# EAGLE board toro10 (EAGLE 7.7.0), part 1 of 2
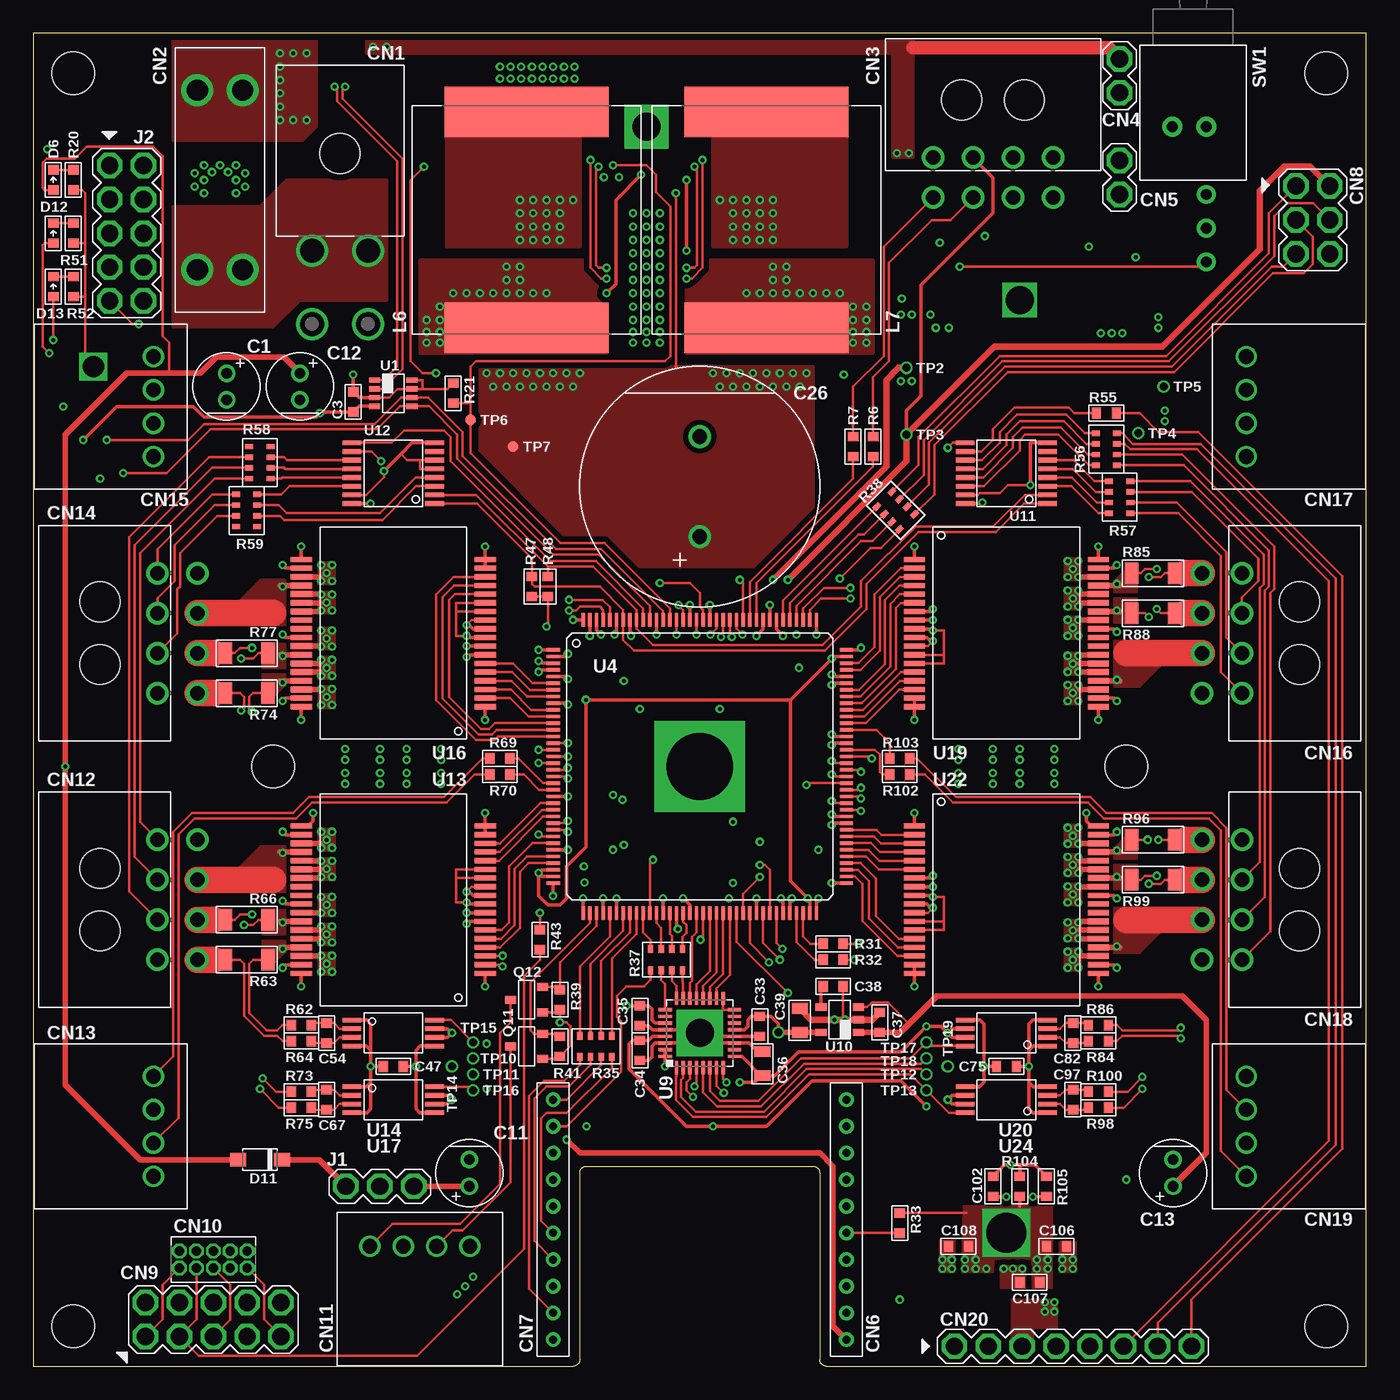
[diagram p14: board, top side]
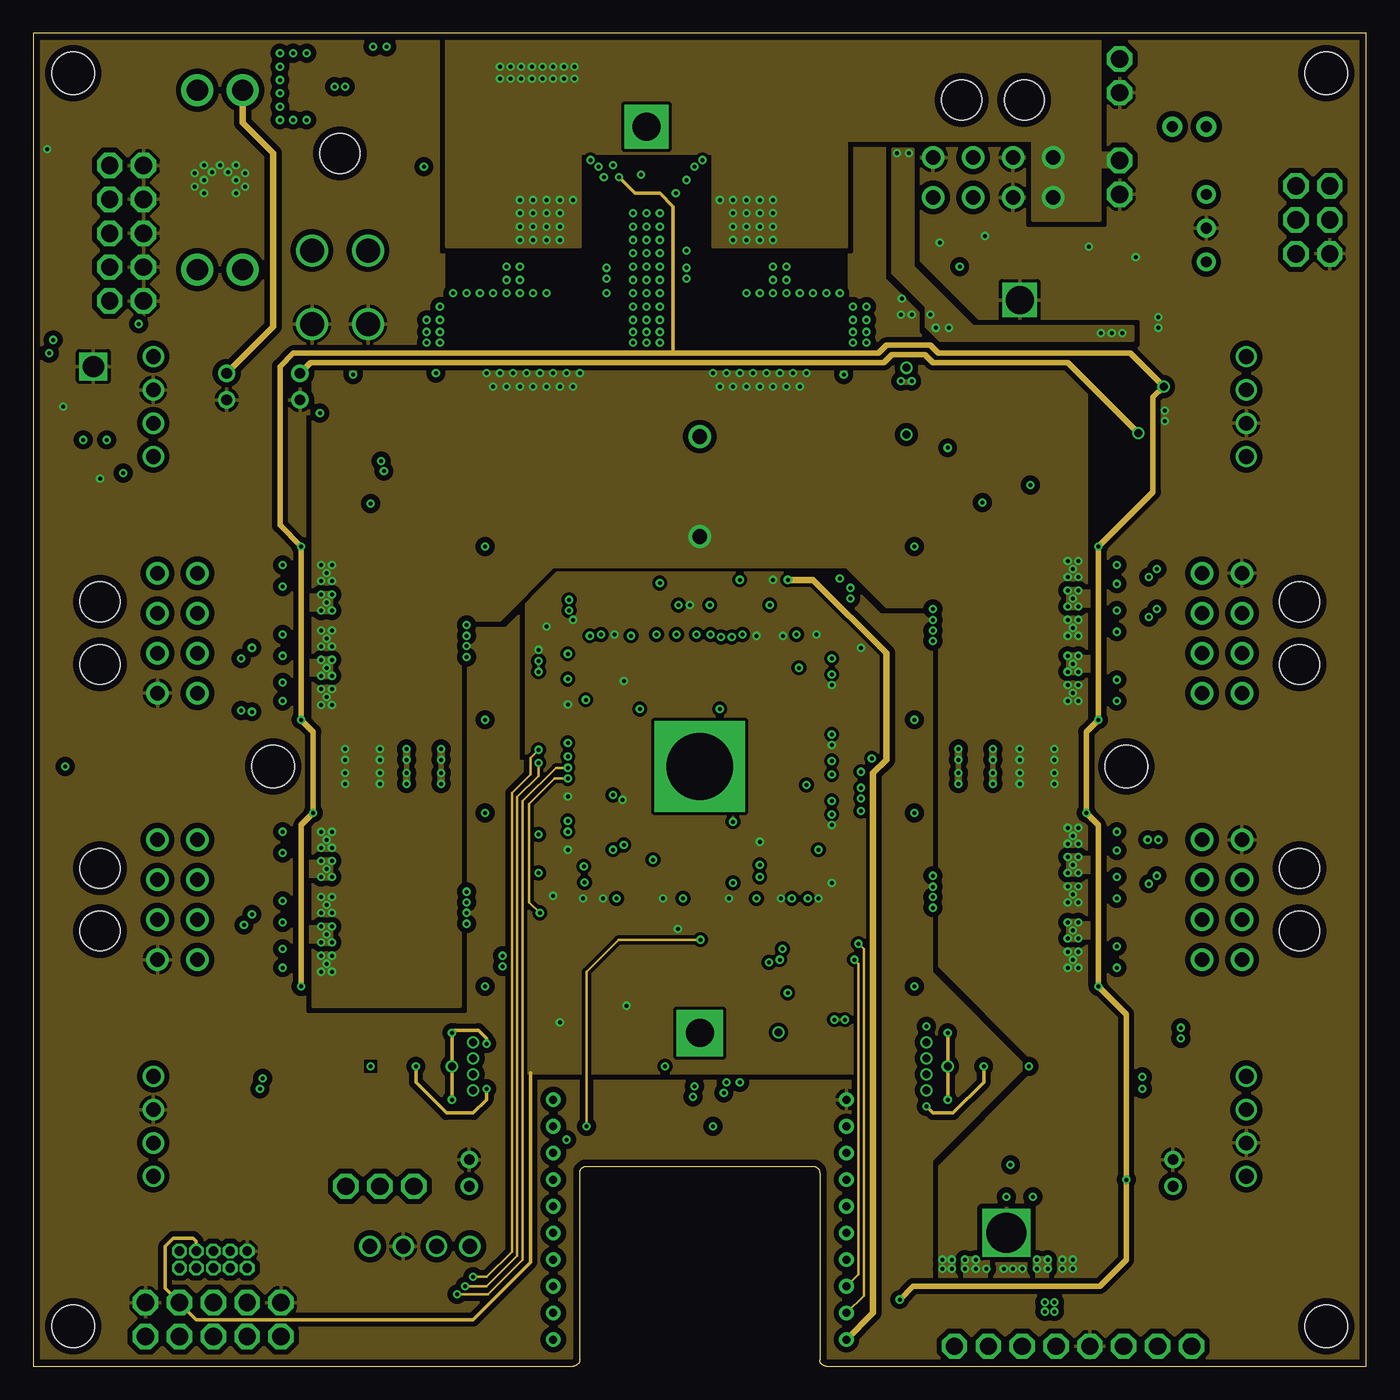
[diagram p15: board, inner layer Route2]
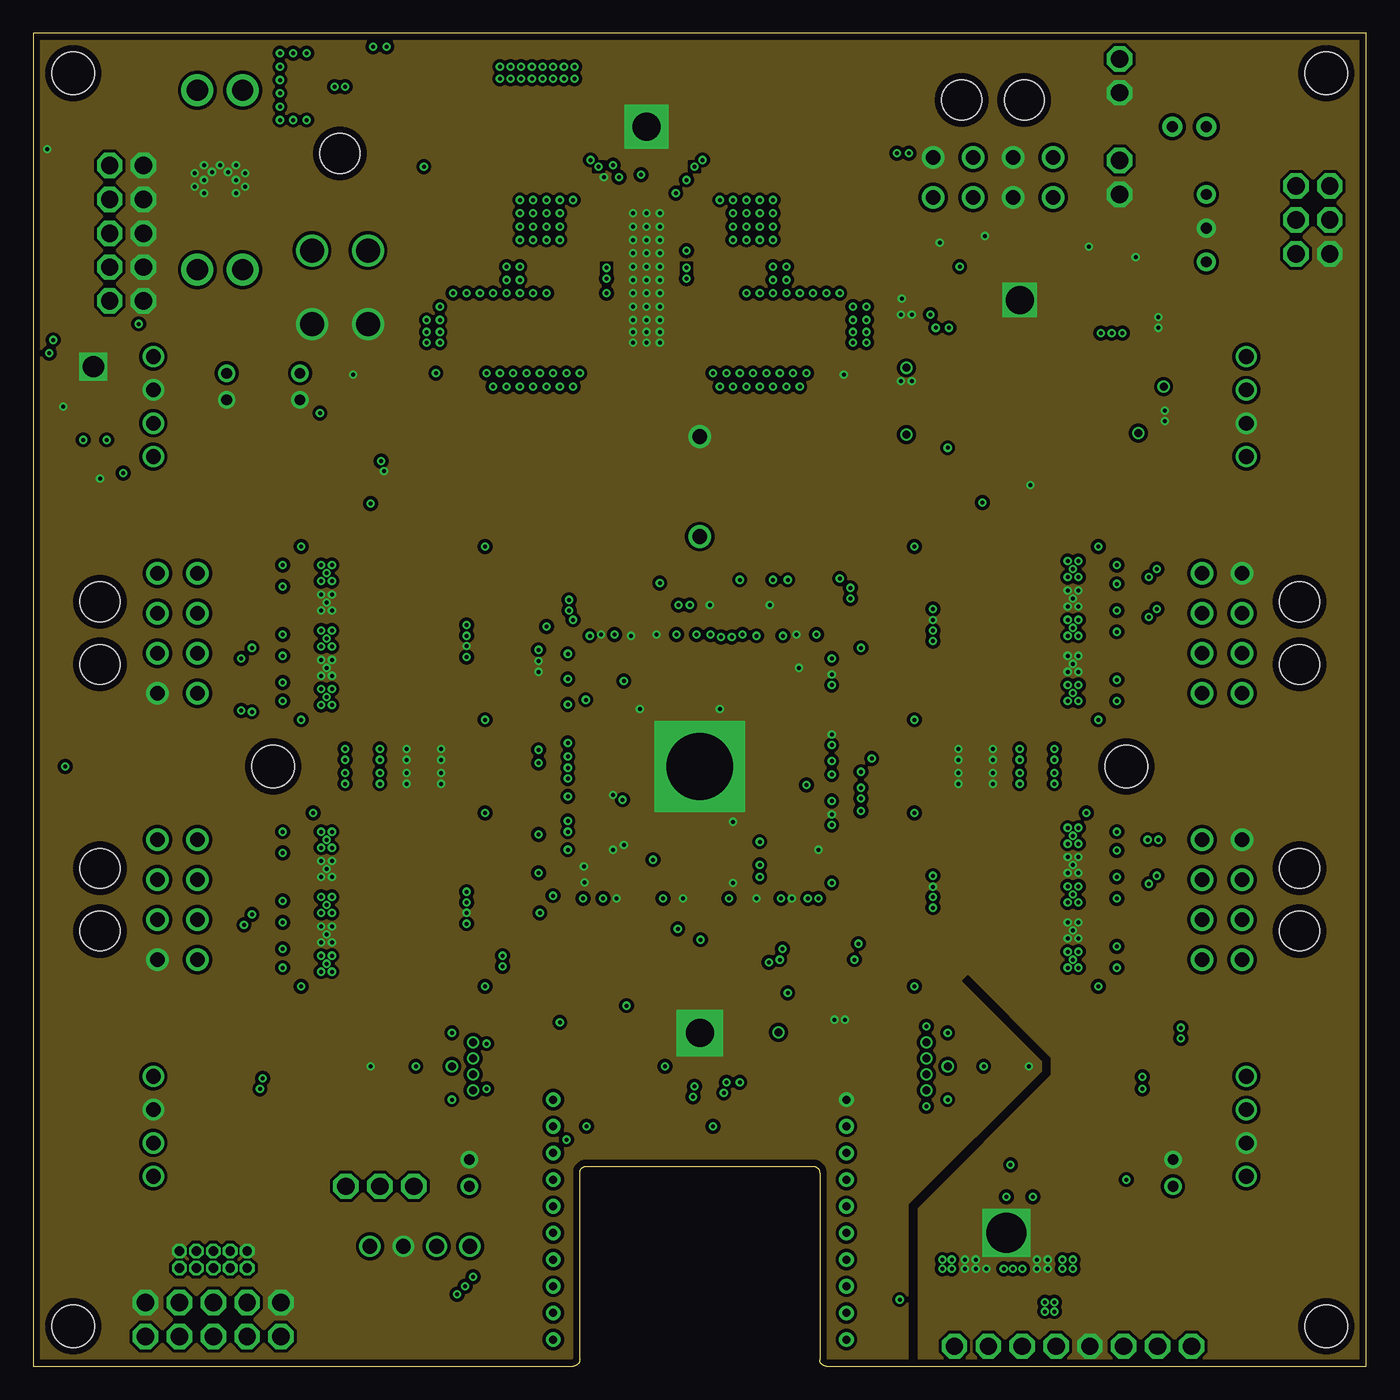
[diagram p16: board, inner layer Route15]
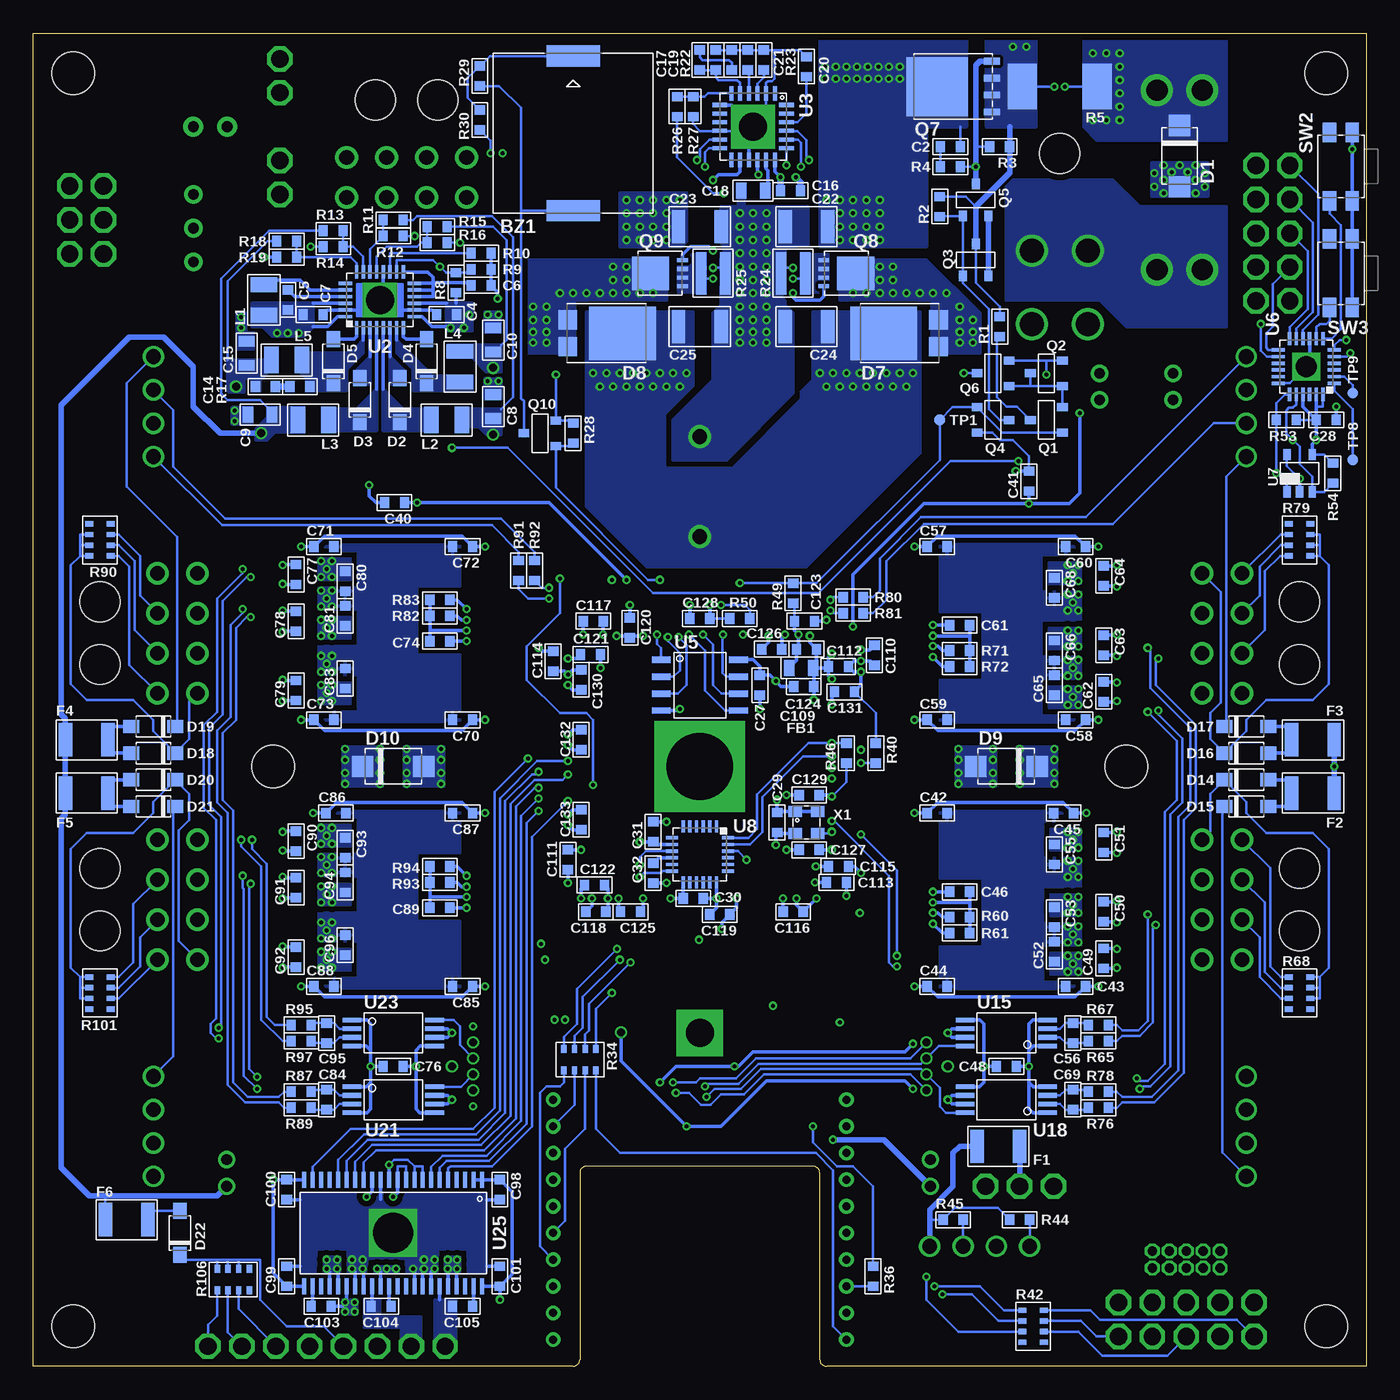
[diagram p17: board, bottom side, seen from below]

Size 100 x 100 mm. Coordinates in mm from the lower left corner, seen from the top.
Outline: 0,0 40.5,0 arc90 41,0.5 41,14.5 arc-90 41.5,15 58.5,15 arc-90 59,14.5 59,0.5 arc90 59.5,0 100,0 100,100 0,100 0,0
Copper layers (1*2*15*16): Top 0.035mm / dielectric 0.2mm / Route2 0.035mm / dielectric 1.2mm / Route15 0.035mm / dielectric 0.2mm / Bottom 0.035mm
Design rules "Elecrow_4-layer_PCB_eagle_rule *": minimum track width 6mil, minimum drill 0.3mm, track to track 6mil, track to pad 6mil, pad to pad 6mil, via to via 6mil, smd to smd 0mil, copper to edge 20mil, drill to drill 10mil, minimum pad ring 6mil, minimum via ring 6mil, stop-mask expansion 2mil, vias tented up to drill 0.3mm, thermal gap 10mil
Holes 3.2 mm at 97,97 97,3 3,3 3,97 18,45 82,45

## Footprints (pad centres in the part's own frame; a part is rotated, then mirrored left to right if it is on the bottom)
PKLCS1212 = smd 1.6 x 4: 1 -5.8,0; 2 5.8,0
E2-5 = drill 0.8 pad 1.3: N 1,0; P -1,0
1608 = smd 0.7 x 0.8: 1 -0.75,0; 2 0.75,0
2012 = smd 0.8 x 1.2: 1 -0.9,0; 2 0.9,0
3225 = smd 1 x 2.5: 1 -1.6,0; 2 1.6,0
E7.5-18 = drill 1.1 pad 1.7: N 3.75,0; P -3.75,0
5569-04A2 = drill 1.8 pad 2.4: 1 -2.1,-7.3; 2 2.1,-7.3; 3 -2.1,-12.8; 4 2.1,-12.8 | hole 3: 0,0
3557 = drill 1.6 pad 2.4: 1 -6.735,1.7; 2 -6.735,-1.7; 3 6.735,-1.7; 4 6.735,1.7
43045-0800 = drill 1.1 pad 1.7: 1 -4.5,-4.32; 2 -1.5,-4.32; 3 1.5,-4.32; 4 4.5,-4.32; 5 -4.5,-7.32; 6 -1.5,-7.32; 7 1.5,-7.32; 8 4.5,-7.32 | hole 3: 2.35,0; -2.35,0
PIN1X2 = drill 1.3 pad 1.9 octagon: 1 -1.27,0; 2 1.27,0
SOCKET1X10-TH2.0 = drill 0.6 pad 1.1: 1 -9,0; 2 -7,0; 3 -5,0; 4 -3,0; 5 -1,0; 6 1,0; 7 3,0; 8 5,0; 9 7,0; 10 9,0
PIN2X3 = drill 1.3 pad 1.9 octagon: 1 -2.54,-1.27; 2 -2.54,1.27; 3 0,-1.27; 4 0,1.27; 5 2.54,-1.27; 6 2.54,1.27
PIN2X5 = drill 1.3 pad 1.9 octagon: 1 -5.08,-1.27; 2 -5.08,1.27; 3 -2.54,-1.27; 4 -2.54,1.27; 5 0,-1.27; 6 0,1.27; 7 2.54,-1.27; 8 2.54,1.27; 9 5.08,-1.27; 10 5.08,1.27
PIN2X5-1.27 = drill 0.7 pad 1.1 octagon: 1 -2.54,-0.635; 2 -2.54,0.635; 3 -1.27,-0.635; 4 -1.27,0.635; 5 0,-0.635; 6 0,0.635; 7 1.27,-0.635; 8 1.27,0.635; 9 2.54,-0.635; 10 2.54,0.635
53426-04 = drill 1.1 pad 1.6: 1 -3.75,0; 2 -1.25,0; 3 1.25,0; 4 3.75,0
PIN1X8 = drill 1.3 pad 1.9 octagon: 1 -8.89,0; 2 -6.35,0; 3 -3.81,0; 4 -1.27,0; 5 1.27,0; 6 3.81,0; 7 6.35,0; 8 8.89,0
DO-214AC = smd 1.6 x 1.6: A 2.3,0; K -2.3,0
SOD123 = smd 1.2 x 1: A 1.65,0; K -1.65,0
1608D = smd 0.7 x 0.8: A 0.75,0; K -0.75,0
TO-277-3 = smd 1.4 x 1.45: 1 2.9,1; 2 2.9,-1 | smd 5 x 4: 3 -1.2,0
PIN1X3 = drill 1.3 pad 1.9 octagon: 1 -2.54,0; 2 0,0; 3 2.54,0
MAMK2520 = smd 1.1 x 2: 1 -1.15,0; 2 1.15,0
L-VISHAY-ER = smd 3.8 x 12.3: 1 -8.1,0; 2 8.1,0
SOT23-3 = smd 0.6 x 0.8: 1 -0.95,-1.2; 2 0.95,-1.2; 3 0,1.2
POWERPAK-SO-8-S = smd 0.5 x 1.2: 1 -1.905,-2.9; 2 -0.635,-2.9; 3 0.635,-2.9; 4 1.905,-2.9 | smd 4.4 x 4.6: D 0,1.2
TSON-8_3.3 = smd 0.8 x 0.32: 1 -1.7,0.975; 2 -1.7,0.325; 3 -1.7,-0.325; 4 -1.7,-0.975 | smd 2.8 x 2.5: D 0.7,0
WSLF2512 = smd 2.2 x 3.4: 1 -2.8,0; 2 2.8,0
3216WL = smd 0.8 x 3.2: 1 -0.9,0; 2 0.9,0
1608-4A = smd 0.6 x 0.4: A1 -0.8,1.2; A2 0.8,1.2; B1 -0.8,0.4; B2 0.8,0.4; C1 -0.8,-0.4; C2 0.8,-0.4; D1 -0.8,-1.2; D2 0.8,-1.2
3216 = smd 1 x 1.6: 1 -1.6,0; 2 1.6,0
B-12JV = drill 0.8 pad 1.4: 1 10.16,1; 2 7.62,1; 3 5.08,1 | drill 0.8 pad 1.5: S1 0,1; S2 0,-1.54
EVQ-PU_BK = smd 1.45 x 1: A1 -2.575,-0.85; A2 2.575,-0.85; B1 -2.575,0.85; B2 2.575,0.85
TESTPAD-SMT = smd 0.8 x 0.8: 1 0,0
TESTPAD-TH = drill 0.6: 1 0,0
SOT23-8 = smd 0.4 x 0.85: 1 -0.975,-1.4; 2 -0.325,-1.4; 3 0.325,-1.4; 4 0.975,-1.4; 5 0.975,1.4; 6 0.325,1.4; 7 -0.325,1.4; 8 -0.975,1.4
QFN28-0.5 = smd 1 x 0.25: 1 -2.1,1.75; 2 -2.1,1.25; 3 -2.1,0.75; 4 -2.1,0.25; 5 -2.1,-0.25; 6 -2.1,-0.75; 7 -2.1,-1.25; 8 -2.1,-1.75; 15 2.1,-1.75; 16 2.1,-1.25; 17 2.1,-0.75; 18 2.1,-0.25; 19 2.1,0.25; 20 2.1,0.75; 21 2.1,1.25; 22 2.1,1.75 | smd 0.25 x 1: 9 -1.25,-2.6; 10 -0.75,-2.6; 11 -0.25,-2.6; 12 0.25,-2.6; 13 0.75,-2.6; 14 1.25,-2.6; 23 1.25,2.6; 24 0.75,2.6; 25 0.25,2.6; 26 -0.25,2.6; 27 -0.75,2.6; 28 -1.25,2.6 | drill 2.1 pad 2.6 square: PAD 0,0
QFN24-0.65 = smd 1.1 x 0.3: 1 -2.5,1.625; 2 -2.5,0.975; 3 -2.5,0.325; 4 -2.5,-0.325; 5 -2.5,-0.975; 6 -2.5,-1.625; 13 2.5,-1.625; 14 2.5,-0.975; 15 2.5,-0.325; 16 2.5,0.325; 17 2.5,0.975; 18 2.5,1.625 | smd 0.3 x 1.1: 7 -1.625,-2.5; 8 -0.975,-2.5; 9 -0.325,-2.5; 10 0.325,-2.5; 11 0.975,-2.5; 12 1.625,-2.5; 19 1.625,2.5; 20 0.975,2.5; 21 0.325,2.5; 22 -0.325,2.5; 23 -0.975,2.5; 24 -1.625,2.5 | drill 2.1 pad 3.3 square: PAD 0,0
QFP144-0.5-PAD = smd 1 x 0.25: 1 -11,8.75; 2 -11,8.25; 3 -11,7.75; 4 -11,7.25; 5 -11,6.75; 6 -11,6.25; 7 -11,5.75; 8 -11,5.25; 9 -11,4.75; 10 -11,4.25; 11 -11,3.75; 12 -11,3.25; 13 -11,2.75; 14 -11,2.25; 15 -11,1.75; 16 -11,1.25; 17 -11,0.75; 18 -11,0.25; 19 -11,-0.25; 20 -11,-0.75; 21 -11,-1.25; 22 -11,-1.75; 23 -11,-2.25; 24 -11,-2.75; 25 -11,-3.25; 26 -11,-3.75; 27 -11,-4.25; 28 -11,-4.75; 29 -11,-5.25; 30 -11,-5.75; 31 -11,-6.25; 32 -11,-6.75; 33 -11,-7.25; 34 -11,-7.75; 35 -11,-8.25; 36 -11,-8.75; 73 11,-8.75; 74 11,-8.25; 75 11,-7.75; 76 11,-7.25; 77 11,-6.75; 78 11,-6.25; 79 11,-5.75; 80 11,-5.25; 81 11,-4.75; 82 11,-4.25; 83 11,-3.75; 84 11,-3.25; 85 11,-2.75; 86 11,-2.25; 87 11,-1.75; 88 11,-1.25; 89 11,-0.75; 90 11,-0.25; 91 11,0.25; 92 11,0.75; 93 11,1.25; 94 11,1.75; 95 11,2.25; 96 11,2.75; 97 11,3.25; 98 11,3.75; 99 11,4.25; 100 11,4.75; 101 11,5.25; 102 11,5.75; 103 11,6.25; 104 11,6.75; 105 11,7.25; 106 11,7.75; 107 11,8.25; 108 11,8.75 | smd 0.25 x 1: 37 -8.75,-11; 38 -8.25,-11; 39 -7.75,-11; 40 -7.25,-11; 41 -6.75,-11; 42 -6.25,-11; 43 -5.75,-11; 44 -5.25,-11; 45 -4.75,-11; 46 -4.25,-11; 47 -3.75,-11; 48 -3.25,-11; 49 -2.75,-11; 50 -2.25,-11; 51 -1.75,-11; 52 -1.25,-11; 53 -0.75,-11; 54 -0.25,-11; 55 0.25,-11; 56 0.75,-11; 57 1.25,-11; 58 1.75,-11; 59 2.25,-11; 60 2.75,-11; 61 3.25,-11; 62 3.75,-11; 63 4.25,-11; 64 4.75,-11; 65 5.25,-11; 66 5.75,-11; 67 6.25,-11; 68 6.75,-11; 69 7.25,-11; 70 7.75,-11; 71 8.25,-11; 72 8.75,-11; 109 8.75,11; 110 8.25,11; 111 7.75,11; 112 7.25,11; 113 6.75,11; 114 6.25,11; 115 5.75,11; 116 5.25,11; 117 4.75,11; 118 4.25,11; 119 3.75,11; 120 3.25,11; 121 2.75,11; 122 2.25,11; 123 1.75,11; 124 1.25,11; 125 0.75,11; 126 0.25,11; 127 -0.25,11; 128 -0.75,11; 129 -1.25,11; 130 -1.75,11; 131 -2.25,11; 132 -2.75,11; 133 -3.25,11; 134 -3.75,11; 135 -4.25,11; 136 -4.75,11; 137 -5.25,11; 138 -5.75,11; 139 -6.25,11; 140 -6.75,11; 141 -7.25,11; 142 -7.75,11; 143 -8.25,11; 144 -8.75,11 | drill 5 pad 6.8 square: PAD 0,0
SOP8 = smd 0.48 x 1.4: 1 -1.905,-2.9; 2 -0.635,-2.9; 3 0.635,-2.9; 4 1.905,-2.9; 5 1.905,2.9; 6 0.635,2.9; 7 -0.635,2.9; 8 -1.905,2.9
QFN24-0.5 = smd 1 x 0.25: 1 -2.1,1.25; 2 -2.1,0.75; 3 -2.1,0.25; 4 -2.1,-0.25; 5 -2.1,-0.75; 6 -2.1,-1.25; 13 2.1,-1.25; 14 2.1,-0.75; 15 2.1,-0.25; 16 2.1,0.25; 17 2.1,0.75; 18 2.1,1.25 | smd 0.25 x 1: 7 -1.25,-2.1; 8 -0.75,-2.1; 9 -0.25,-2.1; 10 0.25,-2.1; 11 0.75,-2.1; 12 1.25,-2.1; 19 1.25,2.1; 20 0.75,2.1; 21 0.25,2.1; 22 -0.25,2.1; 23 -0.75,2.1; 24 -1.25,2.1 | drill 1.6 pad 2.1 square: PAD 0,0
SOT23-5 = smd 0.55 x 0.85: 1 -0.95,-1.4; 2 0,-1.4; 3 0.95,-1.4; 4 0.95,1.4; 5 -0.95,1.4
QFN24-0.5-INVEN = smd 0.9 x 0.25: 1 -2.1,1.25; 2 -2.1,0.75; 3 -2.1,0.25; 4 -2.1,-0.25; 5 -2.1,-0.75; 6 -2.1,-1.25; 13 2.1,-1.25; 14 2.1,-0.75; 15 2.1,-0.25; 16 2.1,0.25; 17 2.1,0.75; 18 2.1,1.25 | smd 0.25 x 0.9: 7 -1.25,-2.1; 8 -0.75,-2.1; 9 -0.25,-2.1; 10 0.25,-2.1; 11 0.75,-2.1; 12 1.25,-2.1; 19 1.25,2.1; 20 0.75,2.1; 21 0.25,2.1; 22 -0.25,2.1; 23 -0.75,2.1; 24 -1.25,2.1
QFN32-0.5 = smd 1 x 0.25: 1 -2.6,1.75; 2 -2.6,1.25; 3 -2.6,0.75; 4 -2.6,0.25; 5 -2.6,-0.25; 6 -2.6,-0.75; 7 -2.6,-1.25; 8 -2.6,-1.75; 17 2.6,-1.75; 18 2.6,-1.25; 19 2.6,-0.75; 20 2.6,-0.25; 21 2.6,0.25; 22 2.6,0.75; 23 2.6,1.25; 24 2.6,1.75 | smd 0.25 x 1: 9 -1.75,-2.6; 10 -1.25,-2.6; 11 -0.75,-2.6; 12 -0.25,-2.6; 13 0.25,-2.6; 14 0.75,-2.6; 15 1.25,-2.6; 16 1.75,-2.6; 25 1.75,2.6; 26 1.25,2.6; 27 0.75,2.6; 28 0.25,2.6; 29 -0.25,2.6; 30 -0.75,2.6; 31 -1.25,2.6; 32 -1.75,2.6 | drill 2.1 pad 3.5 square: PAD 0,0
TSSOP16 = smd 0.35 x 1.4: 1 -2.275,-3.1; 2 -1.625,-3.1; 3 -0.975,-3.1; 4 -0.325,-3.1; 5 0.325,-3.1; 6 0.975,-3.1; 7 1.625,-3.1; 8 2.275,-3.1; 9 2.275,3.1; 10 1.625,3.1; 11 0.975,3.1; 12 0.325,3.1; 13 -0.325,3.1; 14 -0.975,3.1; 15 -1.625,3.1; 16 -2.275,3.1
HSSOP36 = smd 0.381 x 1.6: 1 -5.525,-6.9; 2 -4.875,-6.9; 3 -4.225,-6.9; 4 -3.575,-6.9; 5 -2.925,-6.9; 6 -2.275,-6.9; 7 -1.625,-6.9; 8 -0.975,-6.9; 9 -0.325,-6.9; 10 0.325,-6.9; 11 0.975,-6.9; 12 1.625,-6.9; 13 2.275,-6.9; 14 2.925,-6.9; 15 3.575,-6.9; 16 4.225,-6.9; 17 4.875,-6.9; 18 5.525,-6.9; 19 5.525,6.9; 20 4.875,6.9; 26 0.975,6.9; 27 0.325,6.9; 28 -0.325,6.9; 35 -4.875,6.9; 36 -5.525,6.9 | smd 0.44 x 1.6: 21 4.225,6.9; 22 3.575,6.9; 23 2.925,6.9; 24 2.275,6.9; 25 1.625,6.9; 29 -0.975,6.9; 30 -1.625,6.9; 31 -2.275,6.9; 32 -2.925,6.9; 33 -3.575,6.9; 34 -4.225,6.9
TSSOP8 = smd 0.35 x 1.4: 1 -0.975,-3.1; 2 -0.325,-3.1; 3 0.325,-3.1; 4 0.975,-3.1; 5 0.975,3.1; 6 0.325,3.1; 7 -0.325,3.1; 8 -0.975,3.1
HTSSOP44 = smd 0.3 x 1.2: 1 -6.668,-4; 2 -6.032,-4; 3 -5.397,-4; 4 -4.763,-4; 5 -4.128,-4; 6 -3.493,-4; 7 -2.857,-4; 8 -2.223,-4; 9 -1.587,-4; 10 -0.953,-4; 11 -0.318,-4; 12 0.318,-4; 13 0.953,-4; 14 1.587,-4; 15 2.223,-4; 16 2.857,-4; 17 3.493,-4; 18 4.128,-4; 19 4.763,-4; 20 5.397,-4; 21 6.032,-4; 22 6.668,-4; 23 6.668,4; 24 6.032,4; 25 5.397,4; 26 4.763,4; 27 4.128,4; 28 3.493,4; 29 2.857,4; 30 2.223,4; 31 1.587,4; 32 0.953,4; 33 0.318,4; 34 -0.318,4; 35 -0.953,4; 36 -1.587,4; 37 -2.223,4; 38 -2.857,4; 39 -3.493,4; 40 -4.128,4; 41 -4.763,4; 42 -5.397,4; 43 -6.032,4; 44 -6.668,4 | drill 3 pad 3.6 square: PAD 0,0
OSC2520 = smd 0.8 x 1: 1 -0.825,-0.85; 2 0.825,-0.85; 3 0.825,0.85; 4 -0.825,0.85

## Placement (x,y rotation side)
BZ1  PKLCS1212E4001-R1  [PKLCS1212]  59.5,92.5 90 bottom
C1  47u  [E2-5]  14.5,73.5 270 top
C2  100n  [1608]  31.2,91.5 180 bottom
C3  100n  [1608]  24,72.35 90 top
C4  1u  [1608]  69,78.9 180 bottom
C5  1u  [1608]  80.9,80 270 bottom
C6  100n  [1608]  66.4,81.1 0 bottom
C7  1u  [1608]  79,78.9 0 bottom
C8  10u  [2012]  65.5,72 90 bottom
C9  10u  [2012]  83,71.4 180 bottom
C10  10u  [2012]  65.5,77 90 bottom
C11  100u  [E2-5]  32.7,14.5 90 top
C12  100u  [E2-5]  20,73.5 270 top
C13  100u  [E2-5]  85.5,14.5 90 top
C14  1n  [1608]  82.6,73.5 180 bottom
C15  10u  [2012]  84,76 90 bottom
C16  1u  [1608]  43.2,88.2 0 bottom
C17  10n  [1608]  50,98 90 bottom
C18  10u  [2012]  46,88.2 180 bottom
C19  100p  [1608]  48.8,98 90 bottom
C20  1n  [1608]  42,97.5 90 bottom
C21  100n  [1608]  46.4,98 90 bottom
C22  10u  [3225]  42,85.5 180 bottom
C23  10u  [3225]  50,85.5 0 bottom
C24  10u  [3225]  42,78 180 bottom
C25  10u  [3225]  50,78 0 bottom
C26  390u  [E7.5-18]  50,66 90 top
C27  100n  [1608]  45.5,51.1 270 bottom
C28  100n  [1608]  3,71 0 bottom
C29  10n  [1608]  44.2,40.8 270 bottom
C30  1u  [1608]  50.5,35.1 0 bottom
C31  100n  [1608]  53.5,40.1 90 bottom
C32  1u  [1608]  53.5,37 270 bottom
C33  1u  [1608]  54.5,25.5 270 top
C34  1u  [1608]  45.5,23.7 270 top
C35  1u  [1608]  45.5,26.3 270 top
C36  22u  [2012]  54.7,22.7 90 top
C37  1u  [1608]  63.5,25.8 90 top
C38  10n  [1608]  60,28.5 0 top
C39  10u  [2012]  57.5,25.95 90 top
C40  100n  [1608]  72.9,64.8 180 bottom
C41  100n  [1608]  25.3,66.4 90 bottom
C42  1u  [1608]  32.2,41.5 0 bottom
C43  1u  [1608]  21.8,28.5 180 bottom
C44  1u  [1608]  32.2,28.5 0 bottom
C45  1u  [1608]  22.7,41.5 180 bottom
C46  100n  [1608]  30.5,35.6 180 bottom
C47  100n  [1608]  27,22.5 180 top
C48  100n  [1608]  27,22.5 0 bottom
C49  100n  [1608]  19.7,30.6 90 bottom
C50  100n  [1608]  19.7,34.1 270 bottom
C51  100n  [1608]  19.7,39.3 270 bottom
C52  100n  [1608]  23.4,31.1 90 bottom
C53  100n  [1608]  23.4,33.7 270 bottom
C54  DNC  [1608]  22,25 270 top
C55  100n  [1608]  23.4,38.4 270 bottom
C56  DNC  [1608]  22,25 90 bottom
C57  1u  [1608]  32.2,61.5 0 bottom
C58  1u  [1608]  21.8,48.5 180 bottom
C59  1u  [1608]  32.2,48.5 0 bottom
C60  1u  [1608]  21.8,61.5 180 bottom
C61  100n  [1608]  30.5,55.6 180 bottom
C62  100n  [1608]  19.7,50.6 90 bottom
C63  100n  [1608]  19.7,54.1 270 bottom
C64  100n  [1608]  19.7,59.3 270 bottom
C65  100n  [1608]  23.4,51.1 90 bottom
C66  100n  [1608]  23.4,53.7 270 bottom
C67  DNC  [1608]  22,20 270 top
C68  100n  [1608]  23.4,58.4 270 bottom
C69  DNC  [1608]  22,20 90 bottom
C70  1u  [1608]  67.8,48.5 180 bottom
C71  1u  [1608]  78.2,61.5 0 bottom
C72  1u  [1608]  67.8,61.5 180 bottom
C73  1u  [1608]  78.2,48.5 0 bottom
C74  100n  [1608]  69.5,54.4 0 bottom
C75  100n  [1608]  73,22.5 0 top
C76  100n  [1608]  73,22.5 180 bottom
C77  100n  [1608]  80.3,59.4 270 bottom
C78  100n  [1608]  80.3,55.9 90 bottom
C79  100n  [1608]  80.3,50.7 90 bottom
C80  100n  [1608]  76.6,58.9 270 bottom
C81  100n  [1608]  76.6,56.3 90 bottom
C82  DNC  [1608]  78,25 90 top
C83  100n  [1608]  76.6,51.6 90 bottom
C84  DNC  [1608]  78,20 270 bottom
C85  1u  [1608]  67.8,28.5 180 bottom
C86  1u  [1608]  77.3,41.5 0 bottom
C87  1u  [1608]  67.8,41.5 180 bottom
C88  1u  [1608]  78.2,28.5 0 bottom
C89  100n  [1608]  69.5,34.4 0 bottom
C90  100n  [1608]  80.3,39.4 270 bottom
C91  100n  [1608]  80.3,35.9 90 bottom
C92  100n  [1608]  80.3,30.7 90 bottom
C93  100n  [1608]  76.6,38.9 270 bottom
C94  100n  [1608]  76.6,36.3 90 bottom
C95  DNC  [1608]  78,25 270 bottom
C96  100n  [1608]  76.6,31.6 90 bottom
C97  DNC  [1608]  78,20 90 top
C98  1u  [1608]  65,13.25 270 bottom
C99  1u  [1608]  81,6.75 90 bottom
C100  1u  [1608]  81,13.25 270 bottom
C101  1u  [1608]  65,6.75 90 bottom
C102  100n  [1608]  72,13.5 270 top
C103  100n  [1608]  78.4,4.5 0 bottom
C104  100n  [1608]  73.9,4.5 180 bottom
C105  100n  [1608]  67.8,4.5 180 bottom
C106  100n  [1608]  76.75,9 180 top
C107  100n  [1608]  74.75,6.3 0 top
C108  100n  [1608]  69.4,9 0 top
C109  10u  [2012]  42.4,52.4 180 bottom
C110  100n  [1608]  36.9,53.35 270 bottom
C111  100n  [1608]  59.9,38 90 bottom
C112  100n  [1608]  39.6,52.5 0 bottom
C113  100n  [1608]  39.75,36.3 180 bottom
C114  100n  [1608]  61,52.9 270 bottom
C115  100n  [1608]  39.6,37.5 180 bottom
C116  100n  [1608]  43,34.1 180 bottom
C117  100n  [1608]  58,55.9 0 bottom
C118  100n  [1608]  57.8,34.1 0 bottom
C119  100n  [1608]  48.5,33.9 180 bottom
C120  100n  [1608]  55.25,55.4 90 bottom
C121  100n  [1608]  58.2,53.4 0 bottom
C122  100n  [1608]  57.9,36.1 0 bottom
C123  100n  [1608]  42.15,55.9 180 bottom
C124  100n  [1608]  42,53.8 180 bottom
C125  100n  [1608]  55.2,34.1 0 bottom
C126  100n  [1608]  44.6,53.8 180 bottom
C127  100n  [1608]  41.8,38.75 180 bottom
C128  100n  [1608]  50,56.1 180 bottom
C129  100n  [1608]  41.8,42.85 180 bottom
C130  100n  [1608]  58.9,51.5 90 bottom
C131  100n  [1608]  39.15,50.6 0 bottom
C132  100n  [1608]  58.9,47 90 bottom
C133  100n  [1608]  58.9,41 90 bottom
CN1  5569-04A2  [5569-04A2]  23,91 0 top
CN2  3557-20  [3557]  14,89 270 top
CN3  43045-0800  [43045-0800]  72,95 0 top
CN4  [PIN1X2]  81.5,96.81 270 top
CN5  [PIN1X2]  81.5,89.19 270 top
CN6  SOCKET1X10  [SOCKET1X10-TH2.0]  61,11 90 top
CN7  SOCKET1X10  [SOCKET1X10-TH2.0]  39,11 270 top
CN8  External  [PIN2X3]  96,86 270 top
CN9  ALTERA-JTAG-TH2.54  [PIN2X5]  13.5,3.5 0 top
CN10  ALTERA-JTAG-TH1.27  [PIN2X5-1.27]  13.5,8 0 top
CN11  53426-0410  [53426-04]  29,9 0 top
CN12  43045-0800  [43045-0800]  5,35 90 top
CN13  53426-0410  [53426-04]  9,18 270 top
CN14  43045-0800  [43045-0800]  5,55 90 top
CN15  53426-0410  [53426-04]  9,72 270 top
CN16  43045-0800  [43045-0800]  95,55 270 top
CN17  53426-0410  [53426-04]  91,72 90 top
CN18  43045-0800  [43045-0800]  95,35 270 top
CN19  53426-0410  [53426-04]  91,18 90 top
CN20  PIN1X8  [PIN1X8]  78,1.5 0 top
D1  SMAJ26A  [DO-214AC]  14,90.8 270 bottom
D2  SS2040FL  [SOD123]  72.5,72.5 90 bottom
D3  SS2040FL  [SOD123]  75.5,72.5 90 bottom
D4  SS2040FL  [SOD123]  70.5,75.4 90 bottom
D5  SS2040FL  [SOD123]  77.5,75.4 90 bottom
D6  Orange LED  [1608D]  1.5,89 270 top
D7  FSV2060L  [TO-277-3]  35,77.5 0 bottom
D8  FSV2060L  [TO-277-3]  57,77.5 180 bottom
D9  SMAJ48A  [DO-214AC]  27,45 180 bottom
D10  SMAJ48A  [DO-214AC]  73,45 0 bottom
D11  GS1010FL  [SOD123]  17,15.5 180 top
D12  Green LED  [1608D]  1.5,85 270 top
D13  Red LED  [1608D]  1.5,81 270 top
D14  GS1010FL  [SOD123]  9,44 0 bottom
D15  GS1010FL  [SOD123]  9,42 0 bottom
D16  GS1010FL  [SOD123]  9,46 0 bottom
D17  GS1010FL  [SOD123]  9,48 0 bottom
D18  GS1010FL  [SOD123]  91,46 180 bottom
D19  GS1010FL  [SOD123]  91,48 180 bottom
D20  GS1010FL  [SOD123]  91,44 180 bottom
D21  GS1010FL  [SOD123]  91,42 180 bottom
D22  GS1010FL  [SOD123]  89,10 90 bottom
F1  MICROSMD010-2  [3225]  27.6,16.5 180 bottom
F2  MICROSMD010-2  [3225]  4,43 180 bottom
F3  MICROSMD010-2  [3225]  4,47 180 bottom
F4  MICROSMD010-2  [3225]  96,47 0 bottom
F5  MICROSMD010-2  [3225]  96,43 0 bottom
F6  MICROSMD010-2  [3225]  93,11 0 bottom
FB1  BLM18PG471SN1D  [1608]  42.2,51 0 bottom
J1  JUMPER1X3  [PIN1X3]  26,13.5 0 top
J2  JUMPER2X5  [PIN2X5]  7,85 270 top
L1  4.7u  [MAMK2520]  82.7,80 90 bottom
L2  4.7u  [MAMK2520]  69,71 0 bottom
L3  4.7u  [MAMK2520]  79,71 180 bottom
L4  4.7u  [MAMK2520]  68,75 90 bottom
L5  4.7u  [MAMK2520]  81,75.5 180 bottom
L6  8.2u  [L-VISHAY-ER]  37,86 270 top
L7  8.2u  [L-VISHAY-ER]  55,86 270 top
Q1  BSS138  [SOT23-3]  24,71 90 bottom
Q2  2SC2712  [SOT23-3]  24,74.5 90 bottom
Q3  BSS138  [SOT23-3]  29.3,83 0 bottom
Q4  BSS138  [SOT23-3]  28,71 270 bottom
Q5  BSS138  [SOT23-3]  29.3,87.5 0 bottom
Q6  2SC2712  [SOT23-3]  28,74.5 90 bottom
Q7  SI7135DP  [POWERPAK-SO-8-S]  31,96 90 bottom
Q8  TPN7R506NH  [TSON-8_3.3]  39,82 0 bottom
Q9  TPN7R506NH  [TSON-8_3.3]  53,82 180 bottom
Q10  BSS138  [SOT23-3]  62,70 90 bottom
Q11  BSS138  [SOT23-3]  37,24 90 top
Q12  BSS138  [SOT23-3]  37,27.5 90 top
R1  220k  [1608]  27.5,78 90 bottom
R2  10k  [1608]  32,87 270 bottom
R3  220k  [1608]  27.5,91.5 180 bottom
R4  1k  [1608]  31.2,90 180 bottom
R5  1m  [WSLF2512]  23,96 180 bottom
R6  51  [1608]  63,69 270 top
R7  51  [1608]  61.5,69 270 top
R8  270k  [1608]  68.3,81.3 270 bottom
R9  22k  [1608]  66.4,82.3 180 bottom
R10  10k  [1608]  66.4,83.5 180 bottom
R11  47k  [1608]  73,86 0 bottom
R12  15k  [1608]  73,84.8 180 bottom
R13  130k  [1608]  77.5,85.2 180 bottom
R14  22k  [1608]  77.5,84 0 bottom
R15  130k  [1608]  69.7,85.5 0 bottom
R16  47k  [1608]  69.7,84.3 180 bottom
R17  1k  [1608]  80,73.5 180 bottom
R18  47k  [1608]  81,84.4 180 bottom
R19  3.3k  [1608]  81,83.2 0 bottom
R20  4.7k  [1608]  3,89 90 top
R21  2.2k  [1608]  31.5,73 270 top
R22  68.1k  [1608]  47.6,98 270 bottom
R23  33k  [1608]  45.2,98 270 bottom
R24  5m  [3216WL]  43,82 0 bottom
R25  5m  [3216WL]  49,82 180 bottom
R26  180k  [1608]  51.7,94.5 270 bottom
R27  4.7k  [1608]  50.5,94.5 90 bottom
R28  4.7k  [1608]  59.5,70 270 bottom
R29  1k  [1608]  66.5,96.8 90 bottom
R30  1k  [1608]  66.5,93.5 270 bottom
R31  51  [1608]  60,31.7 0 top
R32  51  [1608]  60,30.5 0 top
R33  2.2k  [1608]  65,10.75 270 top
R34  51  [1608-4A]  59,23 270 bottom
R35  51  [1608-4A]  42.2,24 90 top
R36  51  [1608]  37,6.75 90 bottom
R37  51  [1608-4A]  47.5,30.5 90 top
R38  51  [1608-4A]  64.7,64.2 45 top
R39  4.7k  [1608]  39.5,27.5 270 top
R40  10k  [1608]  36.8,46 270 bottom
R41  4.7k  [1608]  39.5,24 270 top
R42  51  [1608-4A]  25,3 0 bottom
R43  51  [1608]  38,32 270 top
R44  2.2k  [1608]  26,11 180 bottom
R45  2.2k  [1608]  31,11 180 bottom
R46  10k  [1608]  39,46 270 bottom
R47  10k  [1608]  37.4,58.5 270 top
R48  10k  [1608]  38.6,58.5 270 top
R49  2.2k  [1608]  43,58 270 bottom
R50  10k  [1608]  47,56.1 180 bottom
R51  1k  [1608]  3,85 270 top
R52  1k  [1608]  3,81 270 top
R53  2.2k  [1608]  6,71 0 bottom
R54  2.2k  [1608]  2.5,67 90 bottom
R55  10k  [1608]  80.5,71.5 0 top
R56  1k  [1608-4A]  80.5,68.8 0 top
R57  1k  [1608-4A]  81.5,65.2 0 top
R58  1k  [1608-4A]  17,67.8 180 top
R59  1k  [1608-4A]  16,64.2 180 top
R60  1  [1608]  30.5,33.7 0 bottom
R61  22k  [1608]  30.5,32.5 180 bottom
R62  0  [1608]  20.1,25.6 180 top
R63  2m  [3216]  16,30.5 180 top
R64  0  [1608]  20.1,24.4 180 top
R65  0  [1608]  20.1,24.4 0 bottom
R66  2m  [3216]  16,33.5 180 top
R67  0  [1608]  20.1,25.6 0 bottom
R68  100k  [1608-4A]  5,28 0 bottom
R69  1k  [1608]  35,45.6 180 top
R70  1k  [1608]  35,44.4 180 top
R71  1  [1608]  30.5,53.7 0 bottom
R72  22k  [1608]  30.5,52.5 180 bottom
R73  0  [1608]  20.1,20.6 180 top
R74  2m  [3216]  16,50.5 180 top
R75  0  [1608]  20.1,19.4 180 top
R76  0  [1608]  20.1,19.4 0 bottom
R77  2m  [3216]  16,53.5 180 top
R78  0  [1608]  20.1,20.6 0 bottom
R79  100k  [1608-4A]  5,62 0 bottom
R80  1k  [1608]  38.5,57.7 0 bottom
R81  1k  [1608]  38.5,56.5 0 bottom
R82  1  [1608]  69.5,56.3 180 bottom
R83  22k  [1608]  69.5,57.5 0 bottom
R84  0  [1608]  79.9,24.4 0 top
R85  2m  [3216]  84,59.5 0 top
R86  0  [1608]  79.9,25.6 0 top
R87  0  [1608]  79.9,20.6 180 bottom
R88  2m  [3216]  84,56.5 0 top
R89  0  [1608]  79.9,19.4 180 bottom
R90  100k  [1608-4A]  95,62 180 bottom
R91  1k  [1608]  63.6,59.7 90 bottom
R92  1k  [1608]  62.4,59.7 90 bottom
R93  1  [1608]  69.5,36.3 180 bottom
R94  22k  [1608]  69.5,37.5 0 bottom
R95  0  [1608]  79.9,25.6 180 bottom
R96  2m  [3216]  84,39.5 0 top
R97  0  [1608]  79.9,24.4 180 bottom
R98  0  [1608]  79.9,19.4 0 top
R99  2m  [3216]  84,36.5 0 top
R100  0  [1608]  79.9,20.6 0 top
R101  100k  [1608-4A]  95,28 180 bottom
R102  1k  [1608]  65,44.4 0 top
R103  1k  [1608]  65,45.6 0 top
R104  1  [1608]  74,13.5 90 top
R105  47k  [1608]  76,13.5 270 top
R106  100k  [1608-4A]  85,6.5 90 bottom
SW1  B-12JV  [B-12JV]  87,93 270 top
SW2  EVQ-PUB02K  [EVQ-PU_BK]  1.9,90 90 bottom
SW3  EVQ-PUB02K  [EVQ-PU_BK]  1.9,82 90 bottom
TP1  [TESTPAD-SMT]  32,71 0 bottom
TP2  [TESTPAD-TH]  65.5,74.9 0 top
TP3  [TESTPAD-TH]  65.5,69.9 0 top
TP4  [TESTPAD-TH]  82.9,70 0 top
TP5  [TESTPAD-TH]  84.8,73.5 0 top
TP6  [TESTPAD-SMT]  32.8,71 0 top
TP7  [TESTPAD-SMT]  36,69 0 top
TP8  [TESTPAD-SMT]  1,68 90 bottom
TP9  [TESTPAD-SMT]  1,73 90 bottom
TP10  [TESTPAD-TH]  33,23.1 0 top
TP11  [TESTPAD-TH]  33,21.9 0 top
TP12  [TESTPAD-TH]  67,21.9 180 top
TP13  [TESTPAD-TH]  67,20.7 180 top
TP14  [TESTPAD-TH]  31.4,22.5 270 top
TP15  [TESTPAD-TH]  33,24.3 0 top
TP16  [TESTPAD-TH]  33,20.7 0 top
TP17  [TESTPAD-TH]  67,24.3 180 top
TP18  [TESTPAD-TH]  67,23.1 180 top
TP19  [TESTPAD-TH]  68.6,22.5 90 top
U1  INA219  [SOT23-8]  27,73 270 top
U2  LT3504  [QFN28-0.5]  74,80 90 bottom
U3  LTC3862UH-1  [QFN24-0.65]  46,93 270 bottom
U4  10M16SCE144  [QFP144-0.5-PAD]  50,45 0 top
U5  IS25LP016D  [SOP8]  50,51.1 270 bottom
U6  PCAL6416AHF  [QFN24-0.5]  4.5,75 180 bottom
U7  24AA02E48  [SOT23-5]  5,67 0 bottom
U8  ICM-20689  [QFN24-0.5-INVEN]  50,38.4 270 bottom
U9  ADS7223  [QFN32-0.5]  50,25 90 top
U10  SPX3819M5-L-5-0  [SOT23-5]  60.5,26 90 top
U11  SN74LV165APW  [TSSOP16]  73,67 90 top
U12  SN74LV165APW  [TSSOP16]  27,67 90 top
U13  DRV8332  [HSSOP36]  27,35 90 top
U14  INA240A2  [TSSOP8]  27,25 270 top
U15  INA240A2  [TSSOP8]  27,25 90 bottom
U16  DRV8332  [HSSOP36]  27,55 90 top
U17  INA240A2  [TSSOP8]  27,20 270 top
U18  INA240A2  [TSSOP8]  27,20 90 bottom
U19  DRV8332  [HSSOP36]  73,55 270 top
U20  INA240A2  [TSSOP8]  73,25 90 top
U21  INA240A2  [TSSOP8]  73,20 270 bottom
U22  DRV8332  [HSSOP36]  73,35 270 top
U23  INA240A2  [TSSOP8]  73,25 270 bottom
U24  INA240A2  [TSSOP8]  73,20 90 top
U25  DRV8312  [HTSSOP44]  73,10 180 bottom
X1  ASDMB-30.000MHZ-LC-T  [OSC2520]  42,40.8 270 bottom

## Tracks (layer width: path | path; a pad name or v marks a point on that pad's centre or on a via)
!ADC_CS
  Top 0.2: U4.56 50.75,29.65 49.75,28.65 U9.21
!FLASH_CS  (via drill 0.3)
  Top 0.2: U4.121 52.75,55.35 v53.2,54.9
  Bottom 0.2: v53.2,54.9 53.2,54.2 52.9,53.9 U5.1
!IMU_CS  (via drill 0.3)
  Top 0.2: U4.47 46.25,37.75 v46.5,38
  Bottom 0.2: U8.22 47.15,38.65 v46.5,38
!MAX10_CONFIG  (via drill 0.3)
  Top 0.2: U4.129 48.75,56.75 v48.4,57.1
  Bottom 0.2: v48.4,57.1 46.6,57.1 46.25,56.75 R50.1
!MD1_FAULT  (via drill 0.3)
  Top 0.2: U4.29 38.05,39.75 v37.9,39.9 | U13.3 35.17,30.77 v35.2,30.8
  Bottom 0.2: v35.2,30.8 35.2,37.2 v37.9,39.9
!MD1_OTW  (via drill 0.3)
  Top 0.2: U4.27 39.95,40.75 v40.1,40.9 | U13.2 35.08,30.12 v35.2,30
  Bottom 0.2: v35.2,30 35.5,30 35.8,30.3 35.8,36.8 39.9,40.9 v40.1,40.9
!MD1_RESET_U
  Top 0.2: U13.5 35.08,32.08 36.1,33.1 36.1,37.3 37.05,38.25 U4.32
!MD1_RESET_V
  Top 0.2: U13.14 34.92,37.92 38.25,41.25 U4.26
!MD1_RESET_W
  Top 0.2: U13.15 34.98,38.58 38.15,41.75 U4.25
!MD2_FAULT
  Top 0.2: U4.10 37.35,49.25 35.83,50.77 U16.3
!MD2_OTW
  Top 0.2: U4.11 37.15,48.75 35.77,50.12 U16.2
!MD2_RESET_U
  Top 0.2: U4.7 37.25,50.75 35.92,52.08 U16.5
!MD2_RESET_V
  Top 0.2: U4.12 34.65,48.25 34.2,47.8 33.6,47.8 31.2,50.2 31.2,57.5 31.62,57.92 U16.14
!MD2_RESET_W
  Top 0.2: U16.15 31.57,58.58 30.7,57.7 30.7,50.1 33.4,47.4 34.4,47.4 34.75,47.75 U4.13
!MD3_FAULT
  Top 0.2: U4.105 62.05,52.25 63.5,53.7 63.5,57.7 65.03,59.23 U19.3
!MD3_OTW
  Top 0.2: U4.106 61.9,52.75 63.1,53.95 63.1,57.9 65.08,59.88 U19.2
!MD3_RESET_U
  Top 0.2: U4.101 62.05,50.25 64.3,52.5 64.3,57.2 65.03,57.92 U19.5
!MD3_RESET_V
  Top 0.2: U19.14 65.08,52.08 62.25,49.25 U4.99
!MD3_RESET_W
  Top 0.2: U19.15 65.03,51.42 62.35,48.75 U4.98
!MD4_FAULT
  Top 0.2: U22.3 63.58,39.23 63.05,39.75 U4.80
!MD4_OTW
  Top 0.2: U4.81 63.25,40.25 63.62,39.88 U22.2
!MD4_RESET_U
  Top 0.2: U22.5 63.48,37.92 62.65,38.75 U4.78
!MD4_RESET_V
  Top 0.2: U22.14 64.92,32.08 63.2,33.8 63.2,36.6 62.05,37.75 U4.76
!MD4_RESET_W
  Top 0.2: U22.15 64.88,31.43 62.7,33.6 62.7,36.4 61.85,37.25 U4.75
!MD5_FAULT  (via drill 0.3)
  Top 0.2: U4.91 60.05,45.25 v59.9,45.4
  Bottom 0.2: U25.18 77.13,15.47 75.2,17.4 66.8,17.4 65,19.2 65,42.6 62.2,45.4 v59.9,45.4
!MD5_OTW  (via drill 0.3)
  Top 0.2: U4.92 62.75,45.75 v62.9,45.6
  Bottom 0.2: U25.21 79.03,14.97 76.2,17.8 67,17.8 65.4,19.4 65.4,43.1 v62.9,45.6
!MD5_RESET_U  (via drill 0.3)
  Top 0.2: U4.89 60.05,44.25 v59.9,44.4
  Bottom 0.2: U25.16 75.86,15.34 74.6,16.6 66.4,16.6 64.2,18.8 64.2,42.2 62.4,44 60.3,44 v59.9,44.4
!MD5_RESET_V  (via drill 0.3)
  Top 0.2: U4.86 61.95,42.75 v62.1,42.6
  Bottom 0.2: U25.7 70.14,14.96 69.3,15.8 66,15.8 63.4,18.4 63.4,41.3 v62.1,42.6
!MD5_RESET_W  (via drill 0.3)
  Top 0.2: U4.84 62,41.75 v62.1,41.65
  Bottom 0.2: U25.6 69.51,14.89 69,15.4 65.8,15.4 63,18.2 63,40.75 v62.1,41.65
!SR_LOAD
  Top 0.2: U12.1 33.27,64.72 37.4,60.6 R47.1 37.4,58.7 37.6,58.5 42.5,58.5 44.25,56.75 U4.138 44.25,54.5 45.05,53.7 59.4,53.7 62.5,56.8 62.5,58.7 66.4,62.6 72.2,62.6 74.33,64.72 U11.1
!XBEE_RESET  (via drill 0.3)
  Top 0.2: U4.62 53.75,31.75 v55.2,30.3
  Bottom 0.2: v55.2,30.3 58.3,27.2 58.3,25.2 58.6,24.9 R34.B1
!XBEE_SPI_ATTN/INT
  Top 0.2: U4.41 43.25,32.25 41,30 R35.A2
!XBEE_SPI_CS
  Top 0.2: U4.43 44.25,32.65 41.8,30.2 R35.B2
!XBEE_UART_CTS
  Top 0.2: R37.A2 46.3,32 45.75,32.55 U4.46
!XBEE_UART_DTR  (via drill 0.3)
  Top 0.2: U4.64 54.75,31.75 v56,30.5
  Bottom 0.2: R34.C1 59.4,24.8 58.8,25.4 58.8,27.7 v56,30.5
!XBEE_UART_RTS
  Top 0.2: U4.45 45.25,32.45 43.4,30.6 R35.D2
+3V  (via drill 0.3)
  Top 0.2: Q11.1 39.3,23.05 R41.2 40.3,24.05 40.3,25.5 40,25.8 v39.5,25.8 R39.2 39.3,26.55 Q12.1 | v38.5,55.5 38.6,55.6 R48.2 R47.2
  Top 0.25: U4.37 v41.25,35.1 | U4.40 v42.75,35.1 | U4.36 v39,35.3 | U4.72 58.75,34.95 v58.9,35.1 | U4.82 60.05,40.75 v59.9,40.6 | U4.94 60.05,46.75 v59.9,46.6 | U4.103 60.05,51.25 v59.9,51.1 | U4.1 v37.9,53.75 | U4.9 40,49.75 v40.1,49.65 | U4.23 v40.1,42.75 | U4.31 v40.1,38.75 | U4.67 56.25,34.95 v56.1,35.1 | U9.27 46.65,25.75 46.4,26 46.4,26.8 46.15,27.05 C35.1 v44.5,27.05 | U4.73 v59.9,36.25 | U12.16 v25.3,64.72 | U11.16 71.12,64.72 v71.2,64.8 | U4.109 v58.75,54.9 | U4.108 61.95,53.75 v62.1,53.9 | U4.144 v40.5,56 | U4.139 43.75,55.05 v43.6,54.9 | U4.115 55.75,55.3 v56.25,54.8 | U4.117 54.75,55.3 v54.25,54.8 | U4.128 v49.25,57.1 | U1.4 24.43,72.03 C3.1 21.6,71.6 v21.5,71.5 21.2,71.2 12.8,71.2 12,72 6.25,72 v3.75,69.5 | U4.49 v47.25,35.1 | U4.51 48.25,32.9 v48.35,32.8
  Top 0.5: v55.5,59 64,67.5 64,74 64.9,74.9 TP2.1
  Route2 0.25: 37.3,22 37.3,7.8 33,3.5 12.23,3.5 CN9.4 9.9,5.83 9.9,9 10.5,9.6 12,9.6 12.23,9.37 CN10.4
  Bottom 0.2: R15.2 65.5,85.5 64.5,84.5 64.5,77 64.9,76.6 | R50.2 C128.1 | U6.24 3.25,72 3.75,72 | R53.2 C28.1 | R54.2 3.15,68.4 U7.4 | R46.2 39,43.85 v40.1,42.75
  Bottom 0.25: C129.1 40.2,42.85 v40.1,42.75 | v39,35.3 C113.1 | v42.75,35.1 42.75,34.6 C116.1 v41.25,35.1 | C125.1 56.1,34.25 v56.1,35.1 | v58.9,35.1 58.9,35.85 C122.1 | C133.1 59.55,40.25 v59.9,40.6 | C132.1 59.55,46.25 v59.9,46.6 | C130.1 59.55,50.75 v59.9,51.1 | C117.1 v58.75,54.9 | v37.9,53.75 37.25,53.75 C110.1 | C131.1 40.1,50.4 v40.1,49.65 | X1.4 X1.1 44.12,41.62 C29.1 v44.2,42.5 | C127.1 v40.1,38.75 | C111.1 v59.9,36.25 | C41.1 v25.3,64.72 | C40.1 v71.2,64.8 61.3,64.8 v55.5,59 | v25.3,64.72 22.27,64.72 21.5,65.5 v21.5,71.5 | v25.3,64.72 33.17,64.72 38.5,59.4 v38.5,55.5 | C114.1 61.85,53.65 v62.1,53.9 | C123.1 40.6,55.9 v40.5,56 | C126.1 43.85,54.65 v43.6,54.9 | v54.25,54.8 55.1,54.8 C120.1 55.4,54.8 v56.25,54.8 | C128.1 v49.25,57.1 | FB1.1 43.9,51 v44.3,51.4 44.75,51.85 C27.1 45.5,52.5 46.01,53.01 U5.8 | U6.23 3.75,72 C28.1 | U6.21 4.75,72 C28.1 | C28.1 v3.75,69.5 4.05,69.2 U7.4 | v47.25,35.1 47.25,34.4 C119.1 48.35,33.3 v48.35,32.8 | U8.8 53.3,39.15 C31.1 v54.5,39.35 | U8.13 C30.1 v52.2,35.1
  pour Bottom (isolate 0.25, no thermals): 68.9,76.6 68.9,75.7 67.1,75.7 66,74.6 64.9,74.6 64.9,76.6
  pour Route2 (isolate 0.25, rank 3, no thermals): 37,22 37,59.5 57.5,59.5 63.5,53.5 63.5,45.5 62.5,44.5 62.5,22
+3V3  (via drill 0.3)
  Top 0.25: CN3.2 72,89.18 72,86.5 66.6,81.1 66.6,72.8 65.5,71.7 TP3.1
  Top 0.4: J1.3 C11.P | CN6.1 60,3 60,15 59,16 41,16 v40,17
  Top 0.5: v56.6,59 65.5,67.9 TP3.1 72.1,76.5 84.7,76.5 92,83.8 92,88.2 93.8,90 95.81,90 CN8.2
  Route2 0.5: CN6.1 63,4 63,44.5 64,45.5 64,53.5 58.5,59 v56.6,59
  Bottom 0.2: R11.2 71.5,86 71.2,86.3 65.6,86.3 64,84.7 64,72.7 64.9,71.8
  Bottom 0.4: C11.P 36.2,17 v40,17
  pour Bottom (isolate 0.25, no thermals): 68.2,71.8 64.9,71.8 64.9,69.9 66,69.9 66.6,70.5 68.2,70.5
+5V  (via drill 0.3, 0.6)
  Top 0.25: U9.29 46.45,24.75 46.15,24.45 C34.1 44.95,24.45 44.7,24.2 44.7,22.3 49,18 v51,18 55,18 58.4,21.4 65.1,21.4 v67,19.5 | U9.13 53.35,25.25 53.6,25.5 53.6,26 53.85,26.25 C33.1 55.35,26.25 55.9,25.7 v55.9,25.05 | v28.7,22.5 C48.1 | v28.7,22.5 28.7,23.7 29.02,24.02 U14.5 | U17.5 28.98,19.02 28.7,19.3 v28.7,22.5 | C76.1 v71.3,22.5 | v71.3,22.5 71.3,21.3 70.97,20.98 U24.5 | v71.3,22.5 71.3,25.7 71.03,25.98 U20.5
  Top 0.4: U10.5 C39.1 v55.9,25.05
  Route2 0.25: v34,20.8 34,20 33,19 31,19 28.7,21.3 v28.7,22.5 | v67,19.5 67.5,19 69,19 71.3,21.3 v71.3,22.5
  Bottom 0.25: U18.5 29.02,20.98 28.7,21.3 v28.7,22.5 | U15.5 28.98,25.98 28.7,25.7 v28.7,22.5 | C48.1 v28.7,22.5 | v34,20.8 34.6,21.4 45,21.4 48.4,18 v51,18 55.9,22.9 v55.9,25.05 | C76.1 v71.3,22.5 | v71.3,22.5 71.3,23.7 70.97,24.02 U23.5 | v71.3,22.5 71.3,19.3 71.03,19.02 U21.5
+5V5  (via drill 0.3)
  Top 0.2: U10.3 62.55,26.95 62.9,27.3 64.1,27.3 65.7,25.7 | D6.A 0.85,88.25 0.7,88.4 0.7,90.3 1,90.6 3.1,90.6 4,91.5 9,91.5 9.7,90.8 9.7,77.3 10.2,76.8 10.2,74.5
  Top 0.4: D11.A 8,15.5 2.4,21.1 v2.4,45 2.4,69.9 7,74.5 10.2,74.5 12.5,74.5 13.7,75.7 18.8,75.7 C12.P | U10.1 C37.1 65.05,25.05 65.7,25.7 67.8,27.8 86.2,27.8 88,26 88,16 C13.P
  Route2 0.4: TP4.1 77.6,75.3 67.5,75.3 66.9,75.9 64.4,75.9 63.8,75.3 20.8,75.3 C12.P
  Bottom 0.2: R13.2 82.3,85.2 85.9,81.6 85.9,73 85.4,72.5 83,72.5 82.4,71.9 | F6.1 94.6,12.8
  Bottom 0.4: TP4.1 86,70 88,72 88,75 90.2,77.2 92.8,77.2 97.9,72.1 97.9,48.9 97.6,48.6 F4.1 F5.1 97.6,41.4 97.9,41.1 97.9,14.9 95.8,12.8 94.6,12.8 86.2,12.8 C13.P | F2.1 v2.4,45 F3.1
  pour Bottom (isolate 0.25, no thermals): 79.7,71.9 82.4,71.9 82.4,71.2 83.3,70.3 83.3,69.5 82.5,69.5 81.9,70.1 79.7,70.1
+12V  (via drill 0.3)
  Top 0.25: U13.17 U13.18 v33.9,41.5 | U13.36 v20.1,28.5 | U13.1 v33.9,28.5 | U16.19 v20.1,61.5 | v33.9,61.5 U16.18 U16.17 | U16.36 v20.1,48.5 | U16.1 v33.9,48.5 | U19.1 v66.1,61.5 | U19.36 v79.9,61.5 | v66.1,48.5 U19.18 U19.17 | U19.19 v79.9,48.5 | U22.1 v66.1,41.5 | v66.1,28.5 U22.18 U22.17 | U22.19 v79.9,28.5 | U13.19 20.62,40.52 21,40.9 v21,41.5 | v79,41.5 79,40.9 79.38,40.52 U22.36
  Route2 0.25: 48,76 48,87 47,88 45.15,88 v43.95,89.2
  Route2 0.4: v20.1,28.5 20.1,40.6 v21,41.5 21,47.6 v20.1,48.5 v20.1,61.5 18.5,63.1 18.5,75 19.5,76 48,76 63.4,76 64,76.6 67.3,76.6 67.9,76 82.3,76 TP5.1 84,72.7 84,65.6 v79.9,61.5 v79.9,48.5 79,47.6 v79,41.5 79.9,40.6 v79.9,28.5 82,26.4 v82,14 82,8 80,6 66,6 v65,5
  Bottom 0.2: 85.4,75.5 85.4,81.4 82.4,84.4 R18.2
  Bottom 0.25: U3.18 44.38,89.62 v43.95,89.2 | U25.22 C100.1 v82,14 82,7 C99.1 U25.23 | U25.2 U25.1 C98.1 64.1,13.1 64.1,6.9 C101.1 | C101.1 U25.44 | v33.9,41.5 C42.1 32.15,42.3 22.75,42.3 C45.1 v21,41.5 | v20.1,28.5 C43.1 21.85,27.7 32.15,27.7 C44.1 v33.9,28.5 | v20.1,48.5 C58.1 21.85,47.7 32.15,47.7 C59.1 v33.9,48.5 | v33.9,61.5 C57.1 32.15,62.3 21.85,62.3 C60.1 v20.1,61.5 | v79.9,61.5 C71.1 78.15,62.3 67.85,62.3 C72.1 v66.1,61.5 | v66.1,48.5 C70.1 67.85,47.7 78.15,47.7 C73.1 v79.9,48.5 | v79.9,28.5 C88.1 78.15,27.7 67.85,27.7 C85.1 v66.1,28.5 | v66.1,41.5 C87.1 67.85,42.3 77.25,42.3 C86.1 v79,41.5 | C101.1 v65,5
  Bottom 0.5: C16.1 v43.95,89.2
  pour Bottom (isolate 0.25, no thermals): 81.8,75.5 81.8,74.7 82.3,74.7 83,74 83,73.2 83.6,73.2 83.6,74 83.9,74.3 84.2,74 84.2,73.1 85.4,73.1 85.4,75.5
+48V  (via drill 0.3)
  Top 0.2: v48.2,88 48.2,75
  Top 0.4: U13.34 21.5,30.77 | U13.29 21.5,34.02 | U13.21 21.5,39.23 | U16.21 21.5,59.23 | U16.29 21.5,54.02 | U16.34 21.5,50.77 | U19.29 78.5,55.98 | U19.34 78.5,59.23 | U19.21 78.5,50.77 | U22.21 78.5,30.77 | U22.29 78.5,35.98 | U22.34 78.5,39.23
  Bottom 0.2: R26.2 51.7,90.7 49,88 v48.2,88
  Bottom 0.25: U25.40 68.87,7.1 | U25.41 68.24,7.1 | U25.32 73.95,7.1 | U25.27 77.13,7.1 | U25.26 77.76,7.1
  other vias: 34,74.5 35,74.5 36,74.5 37,74.5 38,74.5 39,74.5 40,74.5 41,74.5 34.5,73.5 35.5,73.5 36.5,73.5 37.5,73.5 38.5,73.5 39.5,73.5 40.5,73.5 51,74.5 52,74.5 53,74.5 54,74.5 55,74.5 56,74.5 57,74.5 58,74.5 51.5,73.5 52.5,73.5 53.5,73.5 54.5,73.5 55.5,73.5 56.5,73.5 57.5,73.5 68.2,7.3 68.9,7.3 72.8,7.3 74.2,7.3 77.2,7.3 78,7.3 68.2,8 73.5,7.3 77.2,8 21.6,30.8 22,30.2 22.4,30.8 22.4,34 21.6,34 22,34.6 22,39.5 21.6,40.1 22.4,40.1 21.6,38.9 22.4,38.9 21.6,35.2 22.4,35.2 21.6,29.6 22.4,29.6 21.6,60.1 21.6,55.2 21.6,50.8 22.4,60.1 21.6,58.9 22,59.5 22.4,58.9 22.4,55.2 22,54.6 22.4,54 21.6,54 22.4,50.8 22,50.2 21.6,49.6 22.4,49.6 78.4,49.9 78.4,54.8 78.4,59.2 78.4,60.4 77.6,60.4 78,59.8 77.6,59.2 77.6,54.8 78,55.4 77.6,56 78.4,56 78.4,51.1 77.6,51.1 78,50.5 77.6,49.9 78.4,40.4 78.4,36 78.4,31.1 77.6,40.4 78,39.8 78.4,39.2 77.6,39.2 77.6,36 78,35.4 77.6,34.8 78.4,34.8 77.6,31.1 78,30.5 77.6,29.9 78.4,29.9 23.4,46.3 23.4,45.5 23.4,44.5 23.4,43.7 26,43.7 26,44.5 26,45.5 26,46.3 74,44.5 74,45.5 74,46.3 76.6,46.3 76.6,45.5 76.6,44.5 74,43.7 76.6,43.7 68.9,8 78,8
  pour Bottom (isolate 0.4, rank 2, no thermals): 50.5,79.1 50.5,73 42.5,73 41.5,74 41.5,79.1 33.5,79.1 33.5,68.5 42,60 54,60 58.5,64.5 58.5,79.1
  pour Bottom (isolate 0.4, no thermals): 68,8.2 68,7.1 69.1,7.1 69.1,8.2
  pour Bottom (isolate 0.4, no thermals): 72.6,7.5 72.6,7.1 74.4,7.1 74.4,7.5
  pour Bottom (isolate 0.4, no thermals): 77,8.2 77,7.1 78.2,7.1 78.2,8.2
  pour Top (isolate 0.4, no thermals): 68,7.1 68,9.4 69.1,9.4 69.1,7.1
  pour Top (isolate 0.4, no thermals): 77,7.1 77,9.3 78.2,9.3 78.2,7.1
  pour Top (isolate 0.4, no thermals): 72.6,5.9 72.6,7.5 74.4,7.5 74.4,5.9
  pour Top (isolate 0.4, no thermals): 21.4,40.3 21.4,38.7 22.6,38.7 22.6,40.3
  pour Top (isolate 0.4, no thermals): 21.4,35.4 21.4,33.8 22.6,33.8 22.6,35.4
  pour Top (isolate 0.4, no thermals): 21.4,31 21.4,29.4 22.6,29.4 22.6,31
  pour Bottom (isolate 0.4, no thermals): 21.4,40.3 23.7,40.3 23.7,38.7 21.4,38.7
  pour Bottom (isolate 0.4, no thermals): 21.4,35.4 23.7,35.4 23.7,33.8 21.4,33.8
  pour Bottom (isolate 0.4, no thermals): 21.4,31 23.7,31 23.7,29.4 21.4,29.4
  pour Top (isolate 0.4, no thermals): 21.4,60.3 21.4,58.7 22.6,58.7 22.6,60.3
  pour Top (isolate 0.4, no thermals): 21.4,55.4 21.4,53.8 22.6,53.8 22.6,55.4
  pour Top (isolate 0.4, no thermals): 21.4,51 21.4,49.4 22.6,49.4 22.6,51
  pour Bottom (isolate 0.4, no thermals): 21.4,60.3 23.8,60.3 23.8,58.7 21.4,58.7
  pour Bottom (isolate 0.4, no thermals): 21.4,55.4 23.8,55.4 23.8,53.8 21.4,53.8
  pour Bottom (isolate 0.4, no thermals): 21.4,51 23.8,51 23.8,49.4 21.4,49.4
  pour Top (isolate 0.4, no thermals): 78.6,49.7 78.6,51.3 77.4,51.3 77.4,49.7
  pour Top (isolate 0.4, no thermals): 78.6,54.6 78.6,56.2 77.4,56.2 77.4,54.6
  pour Top (isolate 0.4, no thermals): 78.6,59 78.6,60.6 77.4,60.6 77.4,59
  pour Top (isolate 0.4, no thermals): 78.6,39 78.6,40.6 77.4,40.6 77.4,39
  pour Top (isolate 0.4, no thermals): 78.6,34.6 78.6,36.2 77.4,36.2 77.4,34.6
  pour Top (isolate 0.4, no thermals): 78.6,29.7 78.6,31.3 77.4,31.3 77.4,29.7
  pour Bottom (isolate 0.4, no thermals): 23.2,46.5 23.2,43.5 26.2,43.5 26.2,46.5
  pour Bottom (isolate 0.4, no thermals): 76.8,43.5 76.8,46.5 73.8,46.5 73.8,43.5
  pour Route2 (isolate 0.4, no thermals): 21,27 21,75 79,75 79,28.5 81.5,26 81.5,8.5 79.5,6.5 68,6.5 68,15 75,22 75,23 68,30 68,57 64,57 61,60 39,60 35,56 32,56 32,27
  pour Top (isolate 0.4, no thermals): 33.5,75 33.5,60 58.5,60 58.5,75
  pour Bottom (isolate 0.4, no thermals): 78.6,49.7 76.2,49.7 76.2,51.3 78.6,51.3
  pour Bottom (isolate 0.4, no thermals): 78.6,54.6 76.2,54.6 76.2,56.2 78.6,56.2
  pour Bottom (isolate 0.4, no thermals): 78.6,59 76.2,59 76.2,60.6 78.6,60.6
  pour Bottom (isolate 0.4, no thermals): 78.6,29.7 76.2,29.7 76.2,31.3 78.6,31.3
  pour Bottom (isolate 0.4, no thermals): 78.6,34.6 76.2,34.6 76.2,36.2 78.6,36.2
  pour Bottom (isolate 0.4, no thermals): 78.6,39 76.2,39 76.2,40.6 78.6,40.6
ADC_BUSY
  Top 0.2: U4.52 48.75,33.35 49,33.1 49,32.5 48.7,32.2 R37.D2
ADC_CLOCK
  Top 0.2: U9.22 49.25,28.75 49.4,28.9 49.4,32.2 49.75,32.55 U4.54
ADC_CONVST
  Top 0.2: U4.58 51.75,29.45 50.75,28.45 U9.19
ADC_MISOA
  Top 0.2: R37.B2 47.1,32.9 46.75,33.25 U4.48
ADC_MISOB
  Top 0.2: U4.50 47.75,32.45 47.9,32.3 R37.C2
ADC_MOSI
  Top 0.2: U9.18 51.25,28.35 52.25,29.35 U4.59
ADC_RD
  Top 0.2: U9.20 50.25,28.55 51.25,29.55 U4.57
ADC_REFOUT  (via drill 0.3)
  Top 0.25: v47.4,22.5 U9.32 U9.31 | U9.9 53.15,23.25 54.6,21.8 | v53,21.3 54.1,21.3 54.6,21.8 | 54.6,21.8 C36.1 55.6,21.8 57.4,23.6 65.1,23.6 v67,25.5 68.1,25.5 v68.6,25 | U23.7 68.92,25.32 v68.6,25 | U23.6 68.92,24.68 v68.6,25 | U24.6 68.92,20.32 v68.6,20 68.92,19.68 U24.7 | U18.6 31.07,20.32 v31.4,20 31.07,19.68 U18.7 | U15.6 31.07,25.32 v31.4,25 31.07,24.68 U15.7
  Route2 0.25: v34,24.2 34,24.6 33.4,25.2 31.6,25.2 v31.4,25 TP14.1 v31.4,20 | v68.6,25 TP19.1 v68.6,20
  Bottom 0.25: v34,24.2 34.6,23.6 46,23.6 47.1,22.5 v47.4,22.5 51.8,22.5 v53,21.3 | U23.7 68.92,25.32 v68.6,25 68.92,24.68 U23.6 | U24.6 68.92,20.32 v68.6,20 68.92,19.68 U24.7 | U15.6 31.07,25.32 v31.4,25 31.07,24.68 U15.7 | U18.6 31.07,20.32 v31.4,20 31.07,19.68 U18.7
BALL_SCL
  Top 0.2: R41.1 39.3,24.95 Q11.2 37.55,24.95 37.3,25.2 37.3,28.8 41.75,33.25 U4.38
BALL_SDA/DETECT
  Top 0.2: Q12.2 39.3,28.45 R39.1 39.5,30.3 42.25,33.05 U4.39
BUZZER_PWM  (via drill 0.3)
  Top 0.2: U4.120 53.25,58.75 v53,59
  Bottom 0.2: v53,59 53.9,59 60.8,65.9 Q10.1 59.7,69.05 R28.2
EXT_IO0
  Top 0.2: U4.114 56.25,57.45 R38.A1
EXT_IO1  (via drill 0.3)
  Top 0.2: U4.88 58.15,43.75 v58,43.6 | R38.D1 63.6,61.4 62.8,61.4 v60.5,59.1
  Bottom 0.2: v58,43.6 58,48.5 58.5,49 60.5,49 63,51.5 63,54 60.5,56.5 v60.5,59.1
EXT_IO2
  Top 0.2: U4.113 56.75,57.25 61.9,62.4 62.33,62.4 R38.B1
EXT_IO3
  Top 0.2: U4.112 57.25,57.05 62.1,61.9 62.97,61.9 R38.C1
FLASH_SCK  (via drill 0.3)
  Top 0.2: U4.127 v49.75,54.9
  Bottom 0.2: U5.6 48.37,50.47 49,51.1 49,54.15 v49.75,54.9
FLASH_SIO0  (via drill 0.3)
  Top 0.2: U4.124 51.25,55.35 v50.8,54.9
  Bottom 0.2: U5.5 48.09,49.2 49.6,50.7 49.6,53.7 v50.8,54.9
FLASH_SIO1  (via drill 0.3)
  Top 0.2: U4.122 52.25,54.85 v52.4,54.7
  Bottom 0.2: v52.4,54.7 52.4,54.4 51.5,53.5 51.5,52.2 51.97,51.73 U5.2
FLASH_SIO2  (via drill 0.3)
  Top 0.2: U4.123 51.75,54.85 v51.6,54.7
  Bottom 0.2: U5.3 51.63,50.47 51,51.1 51,54.1 v51.6,54.7
FLASH_SIO3  (via drill 0.3)
  Top 0.2: U4.130 v48.25,54.9
  Bottom 0.2: U5.7 48.03,51.73 48.3,52 48.3,54.85 v48.25,54.9
FPGA_CLKIN1  (via drill 0.3)
  Top 0.2: U4.28 39.95,40.25 v40.1,40.1
  Bottom 0.2: X1.3 40.23,39.98 v40.1,40.1
GND  (via drill 0.3)
  Top 0.2: v43,82.4 42.4,82.4 42.2,82.6 42.2,89.8 v42.4,90 | v49,82.4 49.6,82.4 49.8,82.6 49.8,89.8 v49.6,90 | C38.2 60.75,26.15 v60.9,26 | U9.16 51.75,26.75 | 51.75,26.75 U9.PAD | U9.17 51.75,26.75 | U11.15 70.88,65.38 71,65.5 72.5,65.5 73.1,66.1 v74.8,66.1 | U12.6 29,67.97 | U12.5 29,67.33 29,67.97 | U12.15 24.98,65.38 26.3,66.7 v26.3,67.15 | 29,67.97 28.02,67.97 27.57,68.42 | U1.8 29.2,73.97 29.2,73.33 | U1.3 26.68,72.67 27.32,73.33 U1.7 29.2,73.33 | 29.2,73.33 31.07,73.33 R21.1 | R20.1 3.65,88.25 3.9,88 3.9,84.25 | 3.9,84.25 3.9,80.25 | R52.2 3.9,80.25 | R51.2 3.9,84.25 | 3.9,80.25 3.9,75.6 U6.PAD | R33.1 70,11.5
  Top 0.25: U13.8 v32.5,34.02 | U19.8 v67.5,55.98 | v32.5,54.02 U16.8 | U22.8 v67.5,35.98 | U4.63 v54.25,35.1 | U4.95 60.05,47.25 v59.9,47.4 | U4.83 60.05,41.25 v59.9,41.4 | U4.104 60.05,51.75 v59.9,51.9 | U4.116 v55.25,57.1 | U4.142 42.25,55.25 v42.6,54.9 | U4.3 38.05,52.75 v37.9,52.9 | U4.4 38.05,52.25 v37.9,52.1 | U4.133 v46.75,54.9 | U4.42 v43.75,35.1 | U4.68 56.75,34.95 v56.9,35.1 | C35.2 46.15,25.55 46.45,25.25 U9.28 49.75,25.25 U9.PAD | C34.2 46.15,22.95 46.4,23.2 46.4,24 46.65,24.25 U9.30 49.25,24.25 U9.PAD | U9.PAD 50.25,24.75 U9.12 C33.2 | C36.2 54.35,23.6 53.7,24.25 U9.11 50.75,24.25 U9.PAD | v25.3,22.5 C48.2 | U15.1 24.98,24.02 25.3,23.7 | v25.3,22.5 25.3,23.7 | U14.1 25.02,25.98 25.3,25.7 25.3,23.7 | U18.4 24.98,20.98 25.3,21.3 | U18.1 25.02,19.02 25.3,19.3 25.3,21.3 | v25.3,22.5 25.3,21.3 | v74.7,22.5 C76.2 | 74.7,23.7 75.03,24.02 U23.4 | 74.7,23.7 74.7,25.7 74.97,25.98 U23.1 | 74.7,21.3 75.03,20.98 U24.4 | 74.7,21.3 74.7,19.3 74.97,19.02 U24.1 | v74.7,22.5 74.7,21.3 | 74.7,23.7 v74.7,22.5 | U4.137 44.75,54.9 v44.85,54.8 | U11.8 74.8,69.28 v74.8,66.1 | U4.125 v50.75,57.1 | U12.8 28.43,69.28 27.57,68.42 v26.3,67.15 | U1.3 24.43,72.67 C3.2 v24,74.4 | U4.53 49.25,34.6 v48.75,35.1 | R104.1 74,12
  Top 0.4: U13.32 21.5,32.08 | U13.31 21.5,32.73 | U13.23 21.5,37.92 | U13.25 21.5,36.62 | U13.24 21.5,37.27 | U16.23 21.5,57.92 | U16.24 21.5,57.27 | U16.25 21.5,56.62 | U16.32 21.5,52.08 | U16.31 21.5,52.73 | U19.32 78.5,57.92 | U19.31 78.5,57.27 | U19.23 78.5,52.08 | U19.25 78.5,53.38 | U19.24 78.5,52.73 | U22.25 78.5,33.38 | U22.24 78.5,32.73 | U22.23 78.5,32.08 | U22.32 78.5,37.92 | U22.31 78.5,37.27
  Top 0.5: C37.2 62.95,26 U10.2 v60.9,26 v60.1,26 58.35,26 C39.2
  Bottom 0.2: R12.1 v71.4,84.8 | R16.1 v68,84.3 | R14.1 v79.2,84 | v43,82.4 43.9,82.4 R24.1 | R25.1 48.1,82.4 v49,82.4 | U3.20 42.62,92.03 42.4,91.8 v42.4,90 | U3.12 49.33,91.38 49.6,91.1 v49.6,90 | 44.4,98.75 44.4,96.6 44.6,96.4 44.9,96.4 45.02,96.28 U3.2 45.02,93.97 U3.PAD 46.33,92.67 U3.10 49.98,92.67 50.5,93.2 R27.1 | 44.4,98.75 R23.1 C21.2 R22.1 C19.2 | 44.4,98.75 42.5,98.75 C20.2 | Q4.2 28.05,70.05 27.5,69.5 26.5,69.5 25.3,68.3 C41.2 | Q6.2 24,75.45 | 24,75.45 Q2.2 | v24,74.4 24,75.45 | C123.2 42.9,57.15 R49.2 | v5,66.6 5.95,67.55 U7.5 | U6.18 5.75,73.75 U6.PAD | R40.1 36.8,49 C131.2 | R28.1 59.7,70.95 Q10.2 v60.8,74.4
  Bottom 0.25: U2.PAD 74.75,79.25 U2.27 77.9,79.25 C7.2 | U2.PAD 73.25,79.25 U2.10 70.1,79.25 C4.2 | U2.18 73.75,80.25 U2.PAD | U3.15 46.33,91.67 46,92 U3.PAD 47.62,94.62 U3.7 | R10.1 R9.1 C6.2 65.15,80.6 v65.15,80.1 | C101.2 66,7.5 | C98.2 66,12.5 | C100.2 80,12.5 | C99.2 80,7.5 | U25.38 70.14,7.1 | U25.37 70.78,7.1 | U25.36 71.41,7.1 | U25.30 75.22,7.1 | U25.29 75.86,7.1 | R60.1 31.8,33.7 32.12,34.02 v32.5,34.02 | R71.1 31.8,53.7 32.12,54.02 v32.5,54.02 | R82.1 68.2,56.3 67.88,55.98 v67.5,55.98 | R93.1 68.2,36.3 67.88,35.98 v67.5,35.98 | C116.2 v43.75,35.1 | C115.2 v41.3,37.5 | C127.2 v43.5,38.75 | C113.2 v41.35,36.3 | C129.2 v43.5,42.85 | C125.2 54.25,34.3 v54.25,35.1 | C118.2 56.9,34.25 v56.9,35.1 56.9,35.85 C122.2 | C133.2 59.55,41.75 v59.9,41.4 | C132.2 59.55,47.75 v59.9,47.4 | C130.2 59.55,52.25 v59.9,51.9 60.15,52.15 C114.2 | C121.2 v57.45,52.4 | C110.2 37.2,52.9 v37.9,52.9 38.45,52.9 C112.2 38.45,52.1 v37.9,52.1 37.9,51.1 C131.2 | C109.2 42.75,52.95 C124.2 42.6,53.95 v42.6,54.9 42.9,55.2 C123.2 | v25.3,22.5 25.3,23.7 | 25.3,23.7 25.3,25.7 25.02,25.98 U14.1 | U15.1 24.98,24.02 25.3,23.7 | U18.4 24.98,20.98 25.3,21.3 | U18.1 25.02,19.02 25.3,19.3 25.3,21.3 | 25.3,21.3 v25.3,22.5 | C48.2 v25.3,22.5 | C76.2 v74.7,22.5 | 74.7,21.3 75.03,20.98 U24.4 | 74.7,21.3 74.7,19.3 74.97,19.02 U24.1 | 74.7,21.3 v74.7,22.5 | 74.7,23.7 75.03,24.02 U23.4 | 74.7,23.7 74.7,25.7 74.97,25.98 U23.1 | 74.7,23.7 v74.7,22.5 | X1.2 44.12,39.98 C29.2 44.3,39.95 v44.3,39.1 | C111.2 v58.9,38.75 | C40.2 74.3,64.8 74.8,65.3 v74.8,66.1 | C117.2 v57.25,54.9 | v44.85,54.8 44.85,54.3 C126.2 | C120.2 v55.25,57.1 | v45.5,49.3 C27.2 | U5.4 51.6,49.2 v51.5,49.3 | C128.2 v50.75,57.1
  Bottom 0.25: R19.1 v82.7,83.2 | C41.2 v26.3,67.15 | C28.2 v2.25,72 | U7.2 v5,66.6 | U6.9 4.25,75.25 U6.PAD | v48.75,35.1 48.75,34.4 C119.2 | C30.2 v48.75,35.1 | U8.18 v48.75,35.1 | C31.2 v52.5,40.85 | C32.2 v52.5,36.25 | SW2.A2 v1.05,91.3 SW2.A1 SW3.A2 SW3.A1 | U25.13 73.95,12.5
  Bottom 0.5: C16.2 42.45,88.85 v42.8,89.2
  other vias: 84.4,77.9 84.4,78.7 65.1,78.9 65.9,78.9 65.1,73.9 65.9,73.9 84.9,71.7 84.9,70.9 45,86.5 45,85.5 47,84.5 47,85.5 46,85.5 45,84.5 46,84.5 45,83.5 46,86.5 47,86.5 45,82.5 45,81.5 45,80.5 47,83.5 47,82.5 47,81.5 47,80.5 46,83.5 46,82.5 46,81.5 46,80.5 45,79.5 45,78.5 45,77.6 46,77.6 46,78.5 46,79.5 47,79.5 47,78.5 47,77.6 69.9,7.3 71.5,7.3 69.9,8 70.7,7.3 75.3,7.3 76.1,7.3 76.1,8 75.3,8 21.6,33 21.6,31.8 22.4,31.8 22,32.4 22.4,33 22,37.3 21.6,37.9 22.4,37.9 22.4,36.7 21.6,36.7 12.8,89 13.4,89.6 14.6,89.6 15.9,88.5 15.2,88 12.1,89.5 12.8,88 12.1,88.5 15.2,89 15.9,89.5 15.2,90.1 14,90.1 12.8,90.1 21.6,57.9 21.6,53 21.6,56.7 22.4,57.9 22,57.3 22.4,56.7 22.4,53 22,52.4 22.4,51.8 21.6,51.8 78.4,52.1 78.4,57 78.4,58.2 77.6,58.2 78,57.6 77.6,57 77.6,52.1 78,52.7 77.6,53.3 78.4,53.3 78.4,38.2 78.4,33.3 77.6,38.2 78,37.6 77.6,37 78.4,37 77.6,33.3 78,32.7 78.4,32.1 77.6,32.1 47,76.8 46,76.8 45,76.8 28,44.5 28,43.7 30.6,43.7 30.6,44.5 30.6,45.5 30.6,46.3 28,46.3 28,45.5 72,43.7 69.4,43.7 69.4,44.5 69.4,45.5 69.4,46.3 72,46.3 72,45.5 72,44.5 70.7,8
  pour Bottom (isolate 0.25, rank 2, no thermals): 83.5,79 84.7,79 84.7,76.3 83.5,76.3
  pour Bottom (isolate 0.25, no thermals): 64.9,77.6 64.9,79.1 66.1,79.1 66.1,77.6
  pour Bottom (isolate 0.25, rank 2, no thermals): 64.9,72.6 64.9,74.1 66.1,74.1 66.1,72.6
  pour Bottom (isolate 0.25, rank 2, no thermals): 83.6,71.9 85.1,71.9 85.1,70.7 83.6,70.7
  pour Bottom (isolate 0.4, no thermals): 43,73 43,79 43.6,79.6 43.6,84 41.9,84 41.9,87 46.7,87 46.7,88.6 47.1,88.6 47.1,87 48.4,87 48.4,79.6 49,79 49,74 52,71 52,68 48,68
  pour Bottom (isolate 0.4, rank 2, no thermals): 66,7.1 80,7.1 80,13 66,13
  pour Top (isolate 0.4, rank 2, no thermals): 69.8,12 69.7,7.1 75,7.1 75,5.9 76.4,5.9 76.4,12
  pour Top (isolate 0.4, rank 2, no thermals): 21.4,38.1 21.4,36.5 22.6,36.5 22.6,38.1
  pour Top (isolate 0.4, rank 2, no thermals): 21.4,33.2 21.4,31.6 22.6,31.6 22.6,33.2
  pour Bottom (isolate 0.4, rank 2): 21.4,42 21.4,28 32,28 32,31.5 28.8,31.5 28.8,36.6 32,36.6 32,42
  pour Bottom (isolate 0.25, rank 2, no thermals): 16.1,90.3 16.1,87.8 11.9,87.8 11.9,90.3
  pour Top (isolate 0.4, rank 2, no thermals): 21.4,58.1 21.4,56.5 22.6,56.5 22.6,58.1
  pour Top (isolate 0.4, rank 2, no thermals): 21.4,53.2 21.4,51.6 22.6,51.6 22.6,53.2
  pour Bottom (isolate 0.4, rank 2): 21.4,62 21.4,48 32,48 32,51.5 28.8,51.5 28.8,56.6 32,56.6 32,62
  pour Top (isolate 0.4, rank 2, no thermals): 78.6,51.9 78.6,53.5 77.4,53.5 77.4,51.9
  pour Top (isolate 0.4, rank 2, no thermals): 78.6,56.8 78.6,58.4 77.4,58.4 77.4,56.8
  pour Top (isolate 0.4, rank 2, no thermals): 78.6,36.8 78.6,38.4 77.4,38.4 77.4,36.8
  pour Top (isolate 0.4, rank 2, no thermals): 78.6,31.9 78.6,33.5 77.4,33.5 77.4,31.9
  pour Bottom (isolate 0.4, rank 2, no thermals): 27.8,46.5 27.8,43.5 30.8,43.5 30.8,46.5
  pour Bottom (isolate 0.4, rank 2, no thermals): 72.2,43.5 72.2,46.5 69.2,46.5 69.2,43.5
  cutout Route15 (isolate 0.25, no thermals): 42.6,82.8 42.6,82 43.4,82 43.4,82.8
  cutout Route15 (isolate 0.25, no thermals): 42,90.4 42,89.6 42.8,89.6 42.8,90.4
  cutout Route15 (isolate 0.25, no thermals): 48.6,82.8 48.6,82 49.4,82 49.4,82.8
  cutout Route15 (isolate 0.25, no thermals): 49.2,90.4 49.2,89.6 50,89.6 50,90.4
  pour Route15 (isolate 0.25, rank 6, no thermals): -1,101 101,101 101,-1 -1,-1
  pour Bottom (isolate 0.4, rank 2): 78.6,48 78.6,62 68,62 68,58.5 71.2,58.5 71.2,53.4 68,53.4 68,48
  pour Bottom (isolate 0.4, rank 2): 78.6,28 78.6,42 68,42 68,38.5 71.2,38.5 71.2,33.4 68,33.4 68,28
  pour Route2 (isolate 0.4, rank 6): -1,101 101,101 101,-1 -1,-1
IMU_INT  (via drill 0.3)
  Top 0.2: U4.61 53.25,35.45 v54.5,36.7
  Bottom 0.2: U8.12 52.75,37.15 52.9,37 54.2,37 v54.5,36.7
IMU_MISO  (via drill 0.3)
  Top 0.2: U4.65 55.25,37.25 54.9,37.6 v54.5,37.6
  Bottom 0.2: U8.9 54.05,38.65 54.5,38.2 v54.5,37.6
IMU_MOSI  (via drill 0.3)
  Top 0.2: U4.15 v40.1,46.75
  Bottom 0.2: U4.15 v40.1,46.75 41.85,46.75 45.7,42.9 45.7,40.3 46.35,39.65 U8.24
IMU_SCK  (via drill 0.3)
  Top 0.2: U4.17 v40.1,45.75
  Bottom 0.2: v40.1,45.75 42.25,45.75 45.3,42.7 45.3,40.1 46.25,39.15 U8.23
KICKER_RX_MOSI
  Top 0.2: R6.2 63,67.5 54.25,58.75 U4.118
KICKER_TX_MISO
  Top 0.2: R7.2 61.5,66.6 53.75,58.85 U4.119
MAX10_TCK  (via drill 0.3)
  Top 0.2: U4.18 v37.9,45.25
  Route2 0.2: v37.9,45.25 37.9,44.3 36.3,42.7 36.3,8.3 34,6 v32.4,6